# Altium project IO_Combo_V1_2.PrjPcb
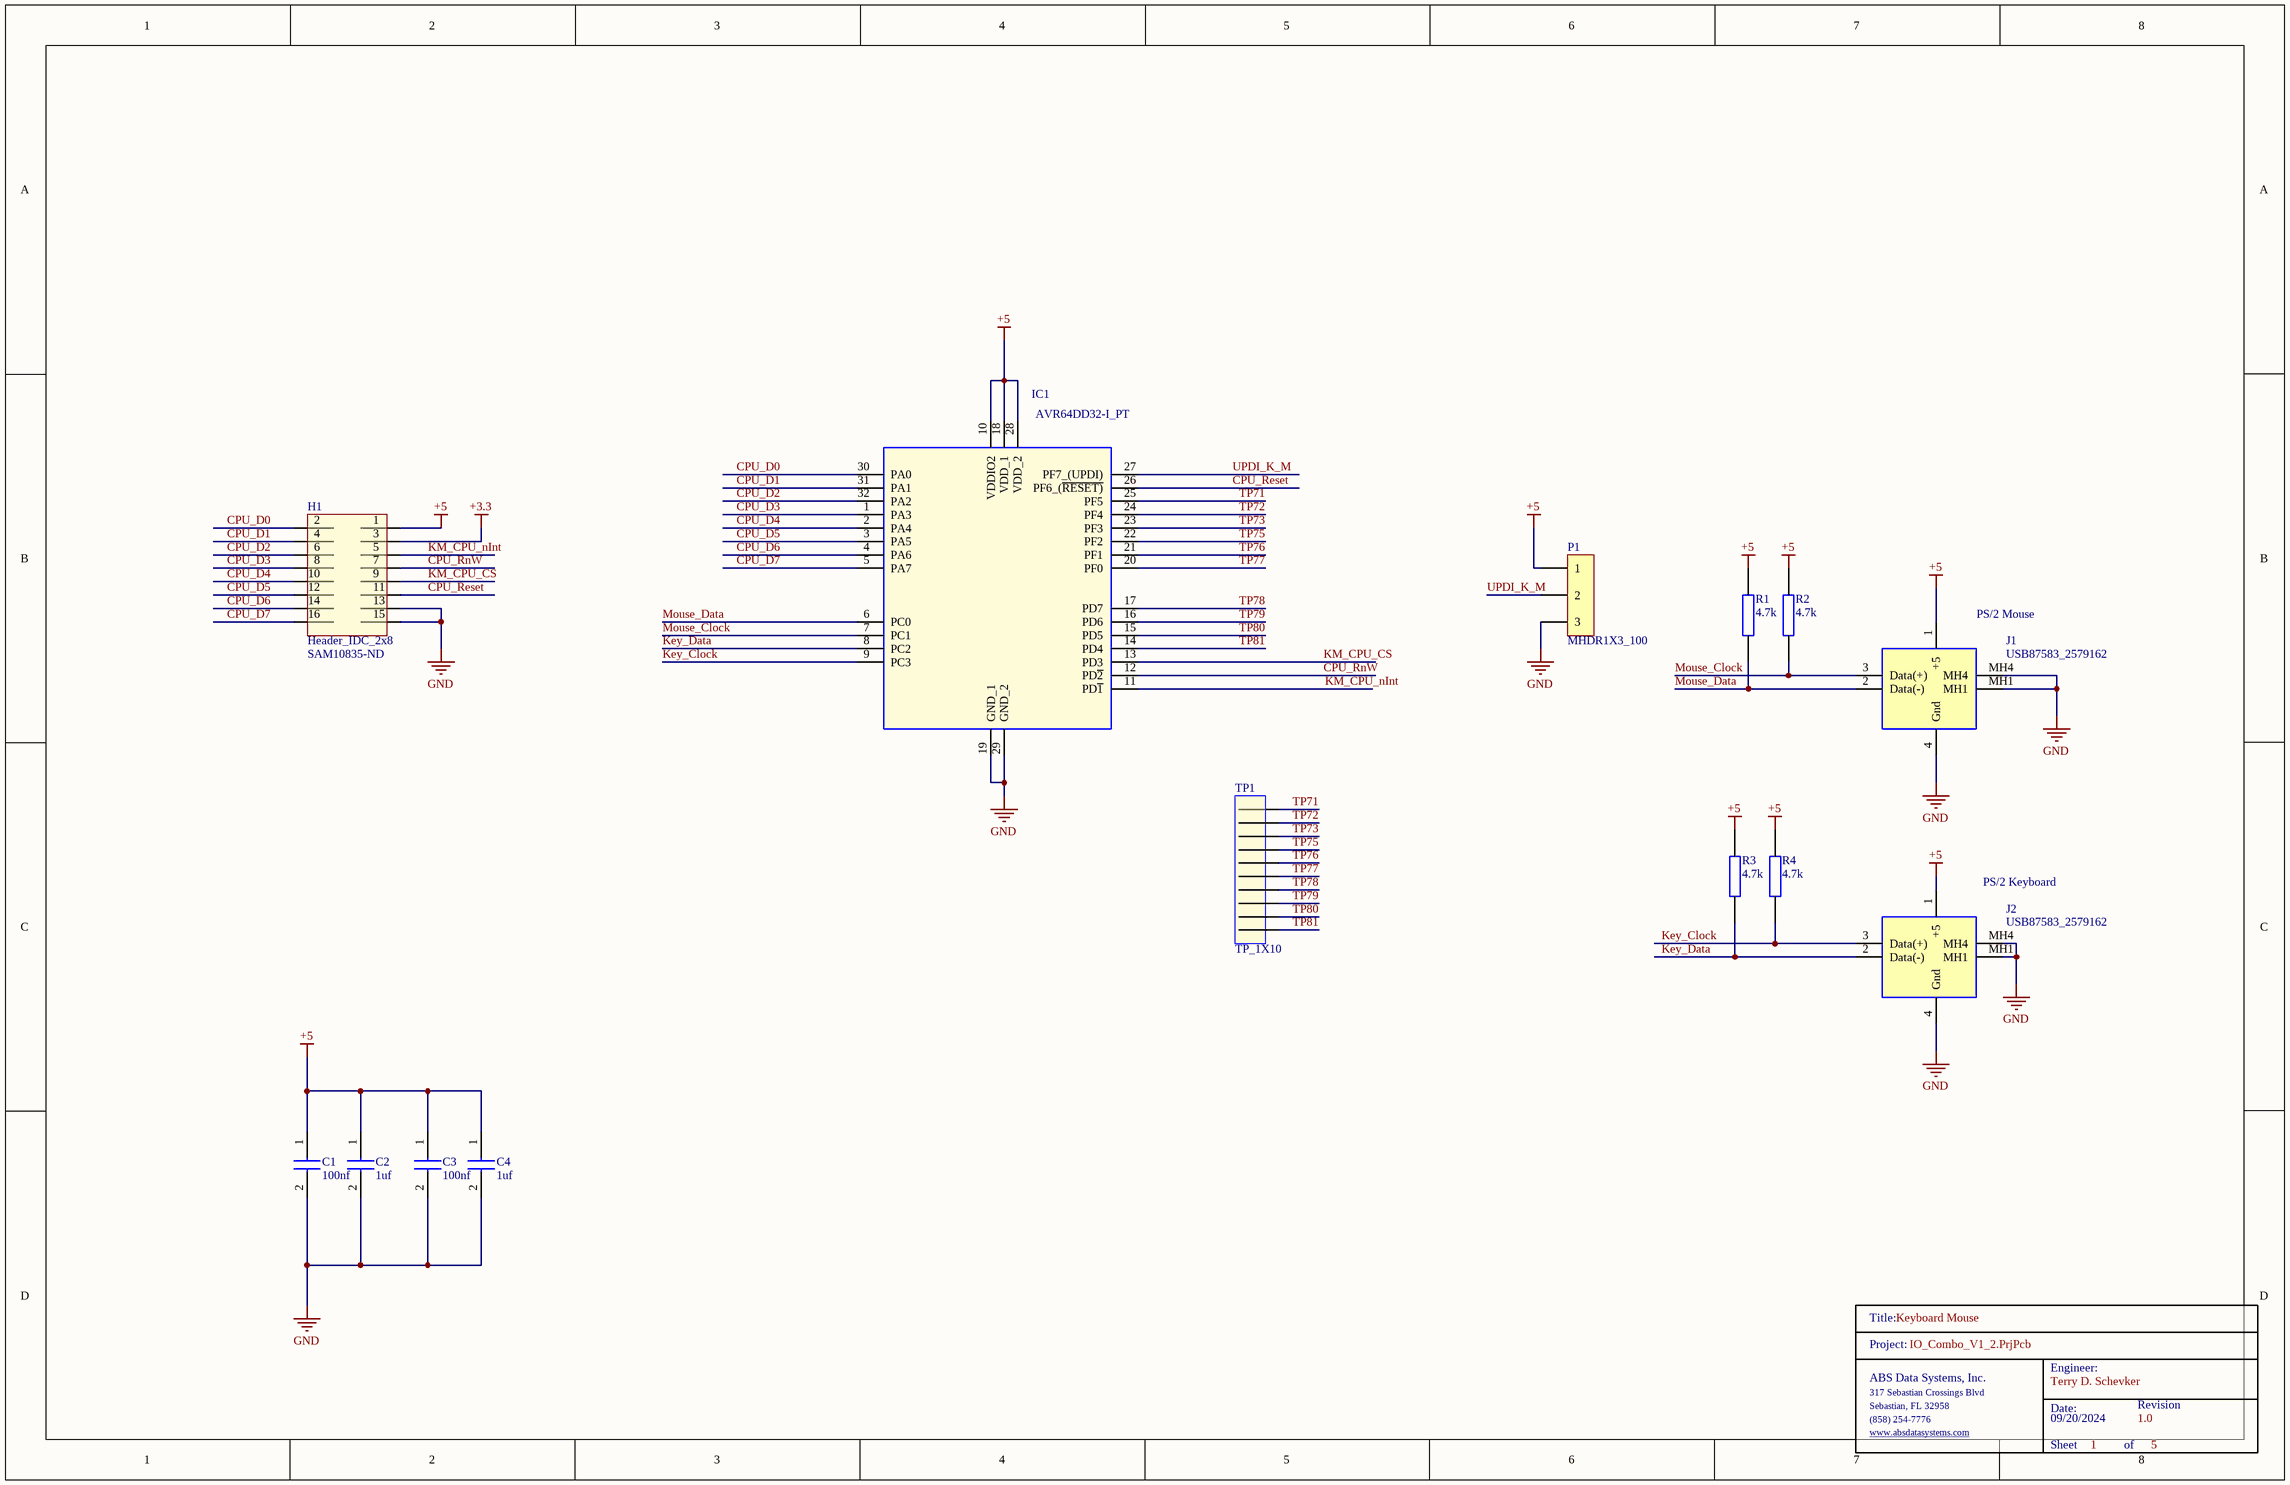
[diagram p0: IO_Combo_Keyboard_Mouse.SchDoc]
5 sheets, 131 parts. Net scope: global (net labels, ports and power ports of the same name join across sheets).
Board file: IO_Combo_V1_2PCB.PcbDoc
Sheets:
  IO_Combo_Keyboard_Mouse.SchDoc
  IO_Combo_LED_Monitor.SchDoc
  IO_Combo_SD.SchDoc
  IO_Combo_USB_Serial.SchDoc
  IO_Combo_WiFi.SchDoc

## Sheet IO_Combo_Keyboard_Mouse.SchDoc: Keyboard Mouse
size Tabloid; Date: 09/20/2024; Engineer: Terry D. Schevker; Revision: 1.0; SheetNumber: 1; SheetTotal: 5

### Parts
(Parts that share a designator on the sheet are numbered #1, #2 ... from top to bottom, then left to right.)
C1  100nf  [0603]
C2  1uf  [0603]
C3  100nf  [0603]
C4  1uf  [0603]
H1  Header_IDC_2x8  Supplier Part Number 1: SAM10835-ND  [HEADER16]
IC1  AVR64DD32-I_PT  [QFP80P900X900X120-32N]
J1  USB87583_2579162  [87583-2579162]
J2  USB87583_2579162  [87583-2579162]
P1  MHDR1X3_100  [MHDR1X3_100]
R1  4.7k  [0603]
R2  4.7k  [0603]
R3  4.7k  [0603]
R4  4.7k  [0603]
TitleBlock_1#1  TitleBlock  (value not drawn)  (graphical)
TP1  TP_1X10  [TP_1X10]

### Nets
+3.3: H1.3
+5: C1.1 C2.1 C3.1 C4.1 H1.1 IC1.10(VDDIO2) IC1.18(VDD_1) IC1.28(VDD_2) J1.1(+5) J2.1(+5) P1.1 R1.1 R2.1 R3.1 R4.1
GND: C1.2 C2.2 C3.2 C4.2 H1.13 H1.15 IC1.19(GND_1) IC1.29(GND_2) J1.4(Gnd) J1.MH1 J1.MH4 J2.4(Gnd) J2.MH1 J2.MH4 P1.3
CPU_D0: H1.2 IC1.30(PA0)
CPU_D1: H1.4 IC1.31(PA1)
CPU_D2: H1.6 IC1.32(PA2)
CPU_D3: H1.8 IC1.1(PA3)
CPU_D4: H1.10 IC1.2(PA4)
CPU_D5: H1.12 IC1.3(PA5)
CPU_D6: H1.14 IC1.4(PA6)
CPU_D7: H1.16 IC1.5(PA7)
CPU_Reset: H1.11 IC1.26(PF6_(~{RESET)})
CPU_RnW: H1.7 IC1.12(PD~{2})
Key_Clock: IC1.9(PC3) J2.3(Data(+)) R4.2
Key_Data: IC1.8(PC2) J2.2(Data(-)) R3.2
KM_CPU_CS: H1.9 IC1.13(PD3)
KM_CPU_nInt: H1.5 IC1.11(PD~{1})
Mouse_Clock: IC1.7(PC1) J1.3(Data(+)) R2.2
Mouse_Data: IC1.6(PC0) J1.2(Data(-)) R1.2
TP71: IC1.25(PF5) TP1.1
TP72: IC1.24(PF4) TP1.2
TP73: IC1.23(PF3) TP1.3
TP75: IC1.22(PF2) TP1.4
TP76: IC1.21(PF1) TP1.5
TP77: IC1.20(PF0) TP1.6
TP78: IC1.17(PD7) TP1.7
TP79: IC1.16(PD6) TP1.8
TP80: IC1.15(PD5) TP1.9
TP81: IC1.14(PD4) TP1.10
UPDI_K_M: IC1.27(PF7_(UPDI)) P1.2

### Notes on the sheet
- (near J1) PS/2 Mouse
- (near J2) PS/2 Keyboard
- (in symbol TitleBlock) Title:; Project:; Engineer:; ABS Data Systems, Inc.; 317 Sebastian Crossings Blvd; Sebastian, FL 32958; Date:; Revision; (858) 254-7776; www.absdatasystems.com; Sheet; of

### Library data of the parts
C1 C3 = CL10B104JB8NNNC: Samsung Electro-Mechanics 0603 100nf
C2 C4 = CL10B105KA8NNNL: Samsung Electro-Mechanics 0603 1uf
H1 = Header_IDC_2x8: 16 Pin 2x8 Through Hold IDC Connector; Manufacturer: Samtec; Manufacturer Part Number: TST-108-01-G-D; Number of Contacts: 16; Gender: Male; Connector Type: Male Pin; Pitch: 2.54mm; Row Spacing: 0.1inch; Supplier 1: Digi-Key; RoHS: Yes; Category: Headers and Wire Housings; Stock 1: 227; Pricing 1: 1=2.85000, 10=2.73600, 100=2.28000, 500=1.93800, 1000=1.65300, 5000=1.48200 (USD); Mount: Through Hole; Contact Plating: Gold; Contact Material: Bronze; Housing Material: Polyester; Housing Color: Black; Color: Black; Min Operating Temperature: -55°C; Max Operating Temperature: 125°C; Number of Rows: 2; Termination: Solder; Packaging: Rail/Tube; Orientation: Straight; Number of Positions: 16; Length: 27.94mm; Depth: 9.27mm; Contact Mating Length: 0.25inch; REACH SVHC: No SVHC; ComponentLink1URL: https://datasheet.ciiva.com/739/tst-mkt-739845.pdf?src-supplier=Digi-Key; ComponentLink1Description: https://datasheet.ciiva.com/739/tst-mkt-739845.pdf?src-supplier=Digi-Key; ComponentLink2URL: https://datasheet.ciiva.com/10018/htst-10018510.pdf?src-supplier=Avnet; ComponentLink2Description: https://datasheet.ciiva.com/10018/htst-10018510.pdf?src-supplier=Avnet
IC1 = AVR64DD32-I_PT: Integrated Circuit; Manufacturer_Name: Microchip; Manufacturer_Part_Number: AVR64DD32-I/PT | MULTI-VOLTAGE I/O; Datasheet Link: https://www.microchip.com/en-us/product/AVR64DD32; Height: 1.2mm
J1 J2 = USB87583_2579162: USB Connectors USB A Plug, SMT, R/A, GF, With Kinked shell stakes and posts, T&R; Manufacturer_Name: GCT (GLOBAL CONNECTOR TECHNOLOGY); Manufacturer_Part_Number: USB1061-GF-L-A; Geometry.Height: 4.6mm; Mouser Part Number: 640-USB1061-GF-L-A; Mouser Price/Stock: https://www.mouser.co.uk/ProductDetail/GCT/USB1061-GF-L-A?qs=KUoIvG%2F9IlYSthVIrIBVzQ%3D%3D; Datasheet Link: https://gct.co/connector/usb1061
P1 = MHDR1X3_100: Header, 3-Pin; LatestRevisionDate: 17-Jul-2002; LatestRevisionNote: Re-released for DXP Platform.; Publisher: Altium Limited
R1-R4 = RC0603FR-104K7L: YAGEO 0603 4.7k; Manufacturer_Name: KEMET; Manufacturer_Part_Number: RC0603JR-070RL; Geometry.Height: 0.55mm; Mouser Part Number: 603-RC0603JR-070RL; Mouser Price/Stock: https://www.mouser.co.uk/ProductDetail/YAGEO/RC0603JR-070RL?qs=2cAdsCoAWRGWyPcuXgGiXQ%3D%3D; Datasheet Link: https://datasheet.datasheetarchive.com/originals/distributors/Datasheets_SAMA/902f9e387b938f871d31120f5fc1d65e.pdf
TP1 = TP_1X10: Manufacturer: Samtec; Manufacturer Part Number: TST-105-01-G-D; Number of Contacts: 16; Gender: Male; Connector Type: Male Pin; Pitch: 2.54mm; Row Spacing: 0.1inch; Supplier 1: Digi-Key; RoHS: Yes; Category: Headers and Wire Housings; Stock 1: 227; Pricing 1: 1=2.85000, 10=2.73600, 100=2.28000, 500=1.93800, 1000=1.65300, 5000=1.48200 (USD); Mount: Through Hole; Contact Plating: Gold; Contact Material: Bronze; Housing Material: Polyester; Housing Color: Black; Color: Black; Min Operating Temperature: -55°C; Max Operating Temperature: 125°C; Number of Rows: 2; Termination: Solder; Packaging: Rail/Tube; Orientation: Straight; Number of Positions: 16; Length: 27.94mm; Depth: 9.27mm; Contact Mating Length: 0.25inch; REACH SVHC: No SVHC; ComponentLink1URL: https://datasheet.ciiva.com/739/tst-mkt-739845.pdf?src-supplier=Digi-Key; ComponentLink1Description: https://datasheet.ciiva.com/739/tst-mkt-739845.pdf?src-supplier=Digi-Key; ComponentLink2URL: https://datasheet.ciiva.com/10018/htst-10018510.pdf?src-supplier=Avnet; ComponentLink2Description: https://datasheet.ciiva.com/10018/htst-10018510.pdf?src-supplier=Avnet

## Sheet IO_Combo_LED_Monitor.SchDoc: LED Monitor
size Tabloid; Date: 09/21/2024; Engineer: Terry D. Schevker; Revision: 1.0; SheetNumber: 2; SheetTotal: 5
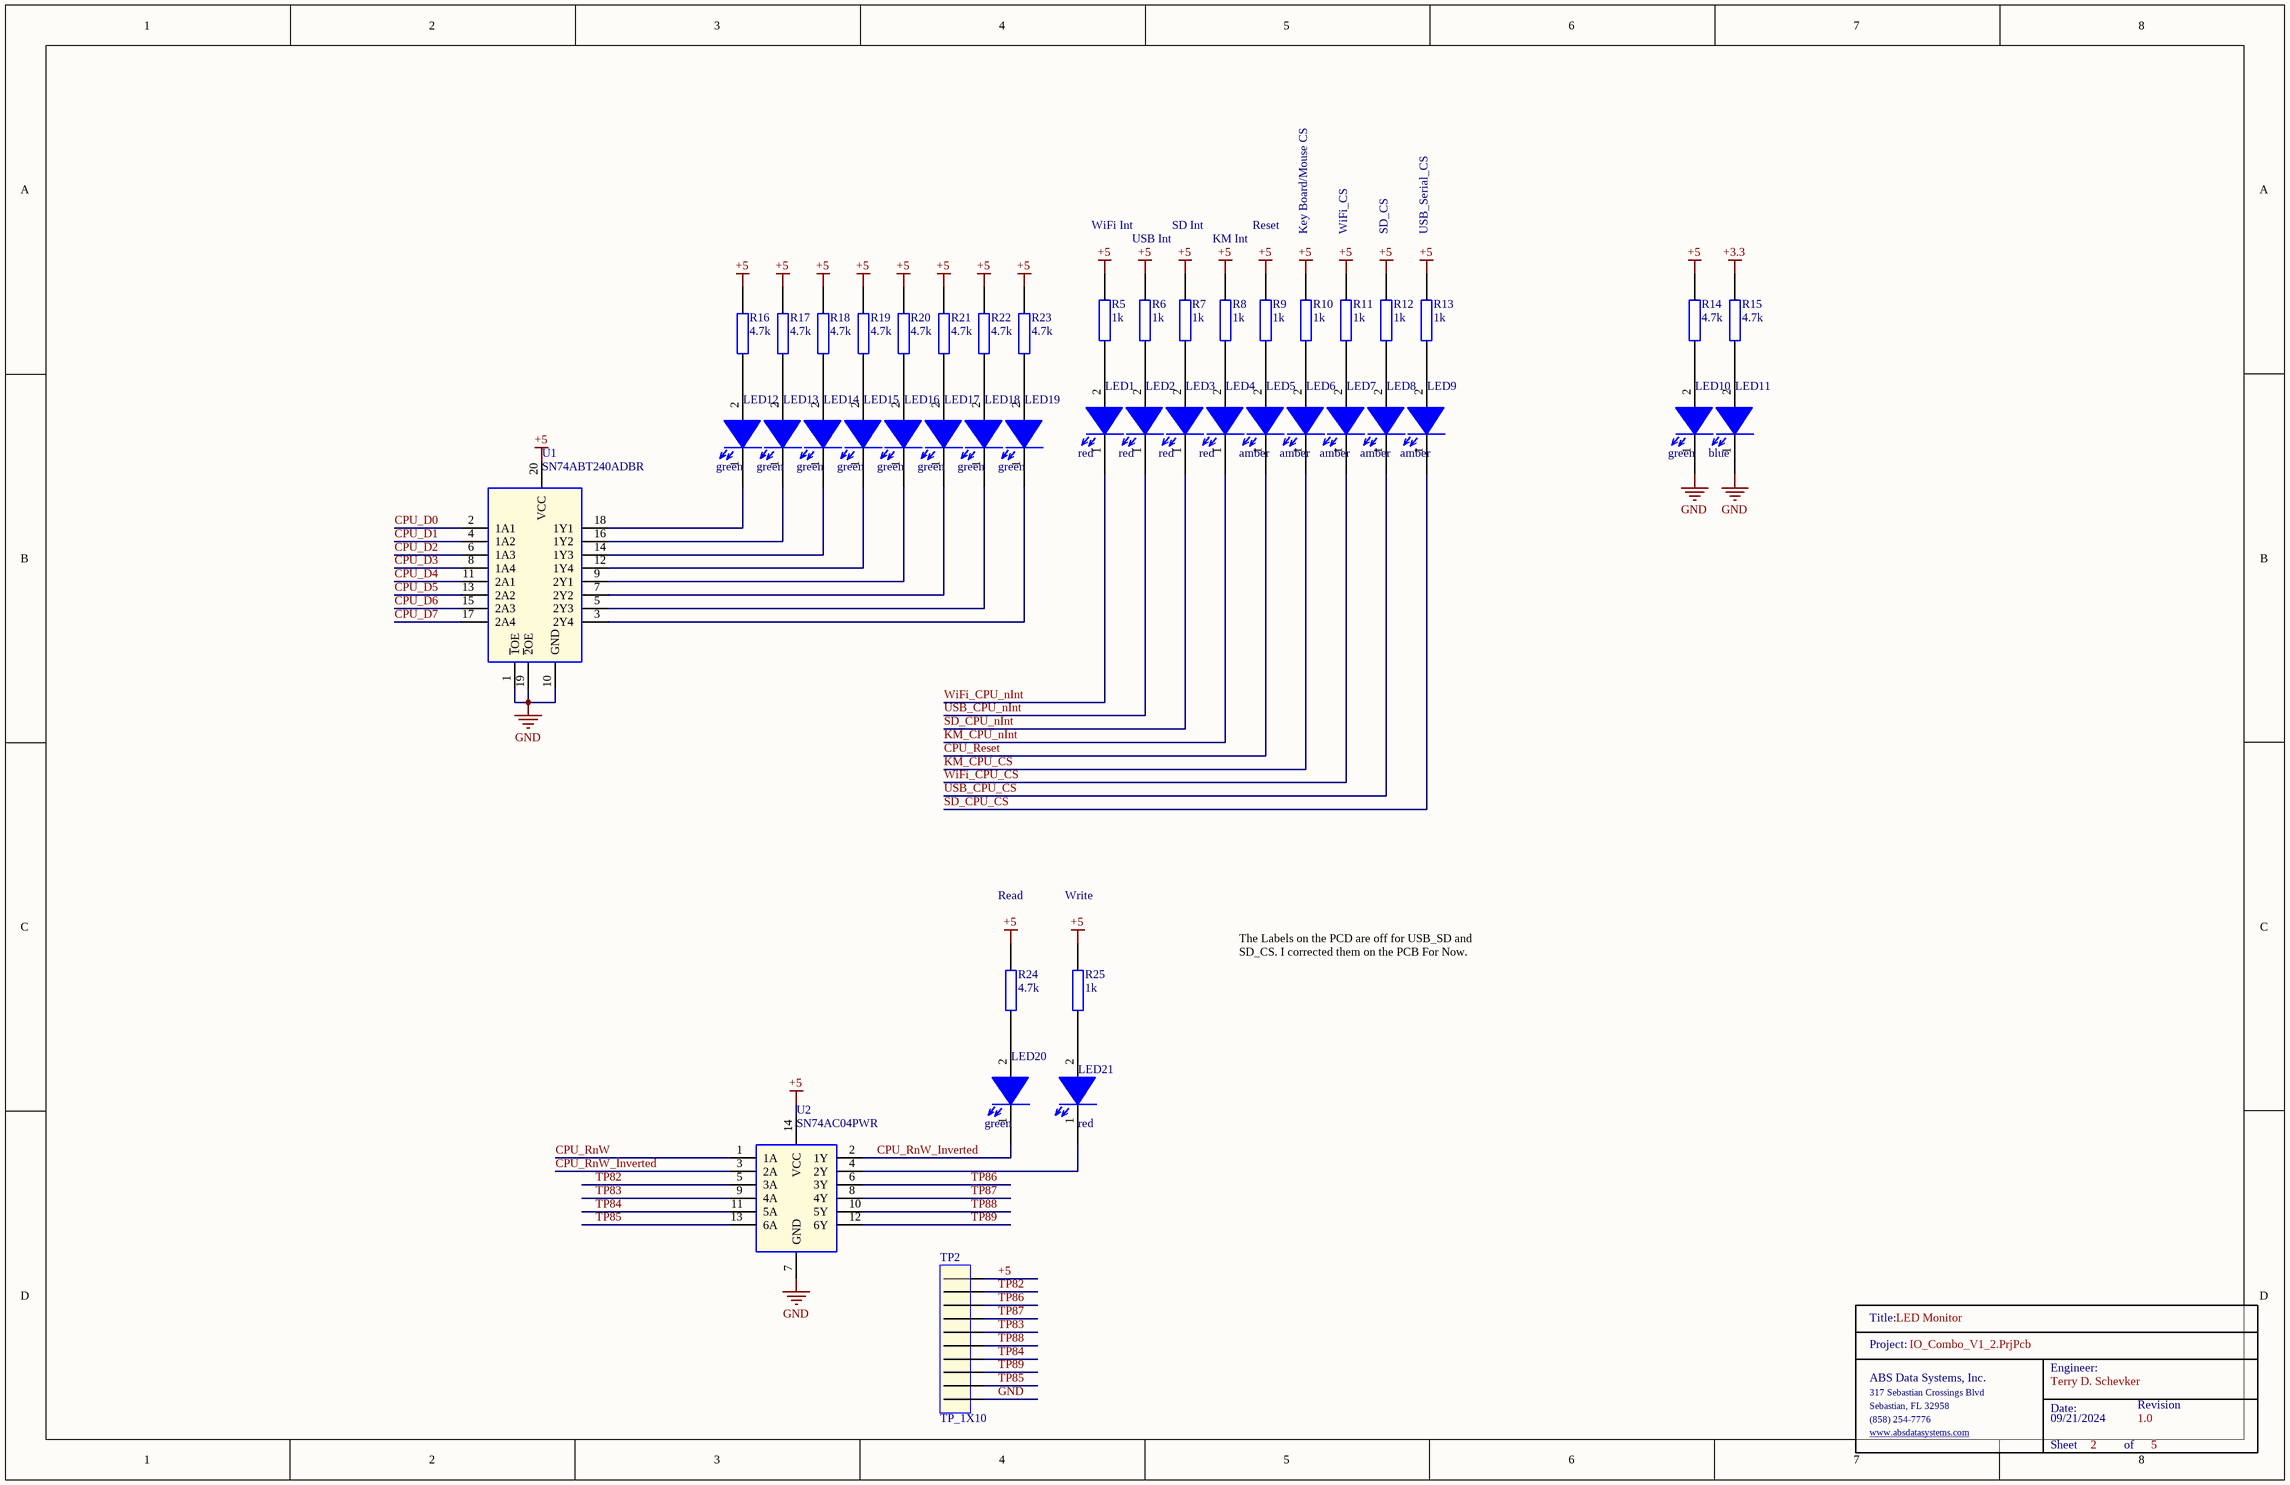
[diagram p1: IO_Combo_LED_Monitor.SchDoc]

### Parts
(Parts that share a designator on the sheet are numbered #1, #2 ... from top to bottom, then left to right.)
LED1  red  [0603_Diode]
LED2  red  [0603_Diode]
LED3  red  [0603_Diode]
LED4  red  [0603_Diode]
LED5  amber  [0603_Diode]
LED6  amber  [0603_Diode]
LED7  amber  [0603_Diode]
LED8  amber  [0603_Diode]
LED9  amber  [0603_Diode]
LED10  green  [0603_Diode]
LED11  blue  [0603_Diode]
LED12  green  [0603_Diode]
LED13  green  [0603_Diode]
LED14  green  [0603_Diode]
LED15  green  [0603_Diode]
LED16  green  [0603_Diode]
LED17  green  [0603_Diode]
LED18  green  [0603_Diode]
LED19  green  [0603_Diode]
LED20  green  [0603_Diode]
LED21  red  [0603_Diode]
R5  1k  [0603]
R6  1k  [0603]
R7  1k  [0603]
R8  1k  [0603]
R9  1k  [0603]
R10  1k  [0603]
R11  1k  [0603]
R12  1k  [0603]
R13  1k  [0603]
R14  4.7k  [0603]
R15  4.7k  [0603]
R16  4.7k  [0603]
R17  4.7k  [0603]
R18  4.7k  [0603]
R19  4.7k  [0603]
R20  4.7k  [0603]
R21  4.7k  [0603]
R22  4.7k  [0603]
R23  4.7k  [0603]
R24  4.7k  [0603]
R25  1k  [0603]
TitleBlock_1#2  TitleBlock  (value not drawn)  (graphical)
TP2  TP_1X10  [TP_1X10]
U1  SN74ABT240ADBR  [SOP65P780X200-20N]
U2  SN74AC04PWR  [SOP65P640X120-14N]

### Nets
+3.3: R15.2
+5: R5.2 R6.2 R7.2 R8.2 R9.2 R10.2 R11.2 R12.2 R13.2 R14.2 R16.2 R17.2 R18.2 R19.2 R20.2 R21.2 R22.2 R23.2 R24.2 R25.2 TP2.1 U1.20(VCC) U2.14(VCC)
GND: LED10.1(K) LED11.1(K) TP2.10 U1.1(~{1}OE) U1.10(GND) U1.19(~{2}OE) U2.7(GND)
CPU_D0: U1.2(1A1)
CPU_D1: U1.4(1A2)
CPU_D2: U1.6(1A3)
CPU_D3: U1.8(1A4)
CPU_D4: U1.11(2A1)
CPU_D5: U1.13(2A2)
CPU_D6: U1.15(2A3)
CPU_D7: U1.17(2A4)
CPU_Reset: LED5.1(K)
CPU_RnW: U2.1(1A)
CPU_RnW_Inverted: LED20.1(K) U2.2(1Y) U2.3(2A)
KM_CPU_CS: LED6.1(K)
KM_CPU_nInt: LED4.1(K)
SD_CPU_CS: LED9.1(K)
SD_CPU_nInt: LED3.1(K)
TP82: TP2.2 U2.5(3A)
TP83: TP2.5 U2.9(4A)
TP84: TP2.7 U2.11(5A)
TP85: TP2.9 U2.13(6A)
TP86: TP2.3 U2.6(3Y)
TP87: TP2.4 U2.8(4Y)
TP88: TP2.6 U2.10(5Y)
TP89: TP2.8 U2.12(6Y)
USB_CPU_CS: LED8.1(K)
USB_CPU_nInt: LED2.1(K)
WiFi_CPU_CS: LED7.1(K)
WiFi_CPU_nInt: LED1.1(K)
NetLED1_2: LED1.2(A) R5.1
NetLED2_2: LED2.2(A) R6.1
NetLED3_2: LED3.2(A) R7.1
NetLED4_2: LED4.2(A) R8.1
NetLED5_2: LED5.2(A) R9.1
NetLED6_2: LED6.2(A) R10.1
NetLED7_2: LED7.2(A) R11.1
NetLED8_2: LED8.2(A) R12.1
NetLED9_2: LED9.2(A) R13.1
NetLED10_2: LED10.2(A) R14.1
NetLED11_2: LED11.2(A) R15.1
NetLED12_1: LED12.1(K) U1.18(1Y1)
NetLED12_2: LED12.2(A) R16.1
NetLED13_1: LED13.1(K) U1.16(1Y2)
NetLED13_2: LED13.2(A) R17.1
NetLED14_1: LED14.1(K) U1.14(1Y3)
NetLED14_2: LED14.2(A) R18.1
NetLED15_1: LED15.1(K) U1.12(1Y4)
NetLED15_2: LED15.2(A) R19.1
NetLED16_1: LED16.1(K) U1.9(2Y1)
NetLED16_2: LED16.2(A) R20.1
NetLED17_1: LED17.1(K) U1.7(2Y2)
NetLED17_2: LED17.2(A) R21.1
NetLED18_1: LED18.1(K) U1.5(2Y3)
NetLED18_2: LED18.2(A) R22.1
NetLED19_1: LED19.1(K) U1.3(2Y4)
NetLED19_2: LED19.2(A) R23.1
NetLED20_2: LED20.2(A) R24.1
NetLED21_1: LED21.1(K) U2.4(2Y)
NetLED21_2: LED21.2(A) R25.1

### Notes on the sheet
- WiFi Int
- SD Int
- Reset
- Key Board/Mouse CS
- WiFi_CS
- SD_CS
- USB_Serial_CS
- USB Int
- KM Int
- Read
- Write
- The Labels on the PCD are off for USB_SD and SD_CS. I corrected them on the PCB For Now.
- (in symbol TitleBlock) Title:; Project:; Engineer:; ABS Data Systems, Inc.; 317 Sebastian Crossings Blvd; Sebastian, FL 32958; Date:; Revision; (858) 254-7776; www.absdatasystems.com; Sheet; of

### Library data of the parts
LED1-LED4 LED21 = 150060RS75000: Wurth Elektronik 0603 red; Manufacturer: Wurth Electronics; Manufacturer Part Number: 150060GS75000; Color: Green; Wavelength: 520nm; Viewing Angle: 140°; Lens Style: Clear,Rectangular; Luminous Intensity: 430mcd; Forward Current: 30mA; Forward Voltage: 3.2V; Test Current: 20mA; Supplier 1: Digi-Key; RoHS: Yes; Category: LEDs; Stock 1: 71509; Pricing 1: 1=0.14000, 50=0.13300, 100=0.11400, 500=0.09900 (USD); Mount: Surface Mount; Case/Package: 0603; Case Code (Metric): 1608; Case Code (Imperial): 0603; Min Operating Temperature: -40°C; Max Operating Temperature: 85°C; Package Quantity: 4000; Packaging: Tape and Reel; Dominant Wavelength: 520nm; Length: 1.6mm; Width: 0.8mm; Height: 0.7mm; REACH SVHC: Unknown; Lead Free: Lead Free; ComponentLink1URL: https://datasheet.ciiva.com/29562/150060gs75000-29562868.pdf?src-supplier=Digi-Key; ComponentLink1Description: https://datasheet.ciiva.com/29562/150060gs75000-29562868.pdf?src-supplier=Digi-Key; ComponentLink2URL: https://datasheet.ciiva.com/29279/759427-da-01-en-chipled-0603-w-kl-gruen-150060gs75000-29279201.pdf?src-supplier=Conrad; ComponentLink2Description: https://datasheet.ciiva.com/29279/759427-da-01-en-chipled-0603-w-kl-gruen-150060gs75000-29279201.pdf?src-supplier=Conrad; ComponentLink3URL: https://datasheet.ciiva.com/29562/150060gs75000-29562869.pdf?src-supplier=Digi-Key; ComponentLink3Description: https://datasheet.ciiva.com/29562/150060gs75000-29562869.pdf?src-supplier=Digi-Key; ComponentLink4URL: https://datasheet.ciiva.com/29562/150060gs75000-29562870.pdf?src-supplier=Digi-Key; ComponentLink4Description: https://datasheet.ciiva.com/29562/150060gs75000-29562870.pdf?src-supplier=Digi-Key
LED5-LED9 = 150060AS75000: Wurth Elektronik 0603 amber; Manufacturer: Wurth Electronics; Manufacturer Part Number: 150060GS75000; Color: Green; Wavelength: 520nm; Viewing Angle: 140°; Lens Style: Clear,Rectangular; Luminous Intensity: 430mcd; Forward Current: 30mA; Forward Voltage: 3.2V; Test Current: 20mA; Supplier 1: Digi-Key; RoHS: Yes; Category: LEDs; Stock 1: 71509; Pricing 1: 1=0.14000, 50=0.13300, 100=0.11400, 500=0.09900 (USD); Mount: Surface Mount; Case/Package: 0603; Case Code (Metric): 1608; Case Code (Imperial): 0603; Min Operating Temperature: -40°C; Max Operating Temperature: 85°C; Package Quantity: 4000; Packaging: Tape and Reel; Dominant Wavelength: 520nm; Length: 1.6mm; Width: 0.8mm; Height: 0.7mm; REACH SVHC: Unknown; Lead Free: Lead Free; ComponentLink1URL: https://datasheet.ciiva.com/29562/150060gs75000-29562868.pdf?src-supplier=Digi-Key; ComponentLink1Description: https://datasheet.ciiva.com/29562/150060gs75000-29562868.pdf?src-supplier=Digi-Key; ComponentLink2URL: https://datasheet.ciiva.com/29279/759427-da-01-en-chipled-0603-w-kl-gruen-150060gs75000-29279201.pdf?src-supplier=Conrad; ComponentLink2Description: https://datasheet.ciiva.com/29279/759427-da-01-en-chipled-0603-w-kl-gruen-150060gs75000-29279201.pdf?src-supplier=Conrad; ComponentLink3URL: https://datasheet.ciiva.com/29562/150060gs75000-29562869.pdf?src-supplier=Digi-Key; ComponentLink3Description: https://datasheet.ciiva.com/29562/150060gs75000-29562869.pdf?src-supplier=Digi-Key; ComponentLink4URL: https://datasheet.ciiva.com/29562/150060gs75000-29562870.pdf?src-supplier=Digi-Key; ComponentLink4Description: https://datasheet.ciiva.com/29562/150060gs75000-29562870.pdf?src-supplier=Digi-Key
LED10 LED12-LED20 = 150060GS75000: Wurth Elektronik 0603 green; Manufacturer: Wurth Electronics; Wavelength: 520nm; Viewing Angle: 140°; Lens Style: Clear,Rectangular; Luminous Intensity: 430mcd; Forward Current: 30mA; Forward Voltage: 3.2V; Test Current: 20mA; Supplier 1: Digi-Key; Manufacturer Part Number: 150060GS75000; RoHS: Yes; Category: LEDs; Stock 1: 71509; Pricing 1: 1=0.14000, 50=0.13300, 100=0.11400, 500=0.09900 (USD); Mount: Surface Mount; Case/Package: 0603; Color: Green; Case Code (Metric): 1608; Case Code (Imperial): 0603; Min Operating Temperature: -40°C; Max Operating Temperature: 85°C; Package Quantity: 4000; Packaging: Tape and Reel; Dominant Wavelength: 520nm; Length: 1.6mm; Width: 0.8mm; Height: 0.7mm; REACH SVHC: Unknown; Lead Free: Lead Free; ComponentLink1URL: https://datasheet.ciiva.com/29562/150060gs75000-29562868.pdf?src-supplier=Digi-Key; ComponentLink1Description: https://datasheet.ciiva.com/29562/150060gs75000-29562868.pdf?src-supplier=Digi-Key; ComponentLink2URL: https://datasheet.ciiva.com/29279/759427-da-01-en-chipled-0603-w-kl-gruen-150060gs75000-29279201.pdf?src-supplier=Conrad; ComponentLink2Description: https://datasheet.ciiva.com/29279/759427-da-01-en-chipled-0603-w-kl-gruen-150060gs75000-29279201.pdf?src-supplier=Conrad; ComponentLink3URL: https://datasheet.ciiva.com/29562/150060gs75000-29562869.pdf?src-supplier=Digi-Key; ComponentLink3Description: https://datasheet.ciiva.com/29562/150060gs75000-29562869.pdf?src-supplier=Digi-Key; ComponentLink4URL: https://datasheet.ciiva.com/29562/150060gs75000-29562870.pdf?src-supplier=Digi-Key; ComponentLink4Description: https://datasheet.ciiva.com/29562/150060gs75000-29562870.pdf?src-supplier=Digi-Key
LED11 = 150060BS75000: Wurth Elektronik 0603 blue; Manufacturer: Wurth Electronics; Manufacturer Part Number: 150060GS75000; Color: Green; Wavelength: 520nm; Viewing Angle: 140°; Lens Style: Clear,Rectangular; Luminous Intensity: 430mcd; Forward Current: 30mA; Forward Voltage: 3.2V; Test Current: 20mA; Supplier 1: Digi-Key; RoHS: Yes; Category: LEDs; Stock 1: 71509; Pricing 1: 1=0.14000, 50=0.13300, 100=0.11400, 500=0.09900 (USD); Mount: Surface Mount; Case/Package: 0603; Case Code (Metric): 1608; Case Code (Imperial): 0603; Min Operating Temperature: -40°C; Max Operating Temperature: 85°C; Package Quantity: 4000; Packaging: Tape and Reel; Dominant Wavelength: 520nm; Length: 1.6mm; Width: 0.8mm; Height: 0.7mm; REACH SVHC: Unknown; Lead Free: Lead Free; ComponentLink1URL: https://datasheet.ciiva.com/29562/150060gs75000-29562868.pdf?src-supplier=Digi-Key; ComponentLink1Description: https://datasheet.ciiva.com/29562/150060gs75000-29562868.pdf?src-supplier=Digi-Key; ComponentLink2URL: https://datasheet.ciiva.com/29279/759427-da-01-en-chipled-0603-w-kl-gruen-150060gs75000-29279201.pdf?src-supplier=Conrad; ComponentLink2Description: https://datasheet.ciiva.com/29279/759427-da-01-en-chipled-0603-w-kl-gruen-150060gs75000-29279201.pdf?src-supplier=Conrad; ComponentLink3URL: https://datasheet.ciiva.com/29562/150060gs75000-29562869.pdf?src-supplier=Digi-Key; ComponentLink3Description: https://datasheet.ciiva.com/29562/150060gs75000-29562869.pdf?src-supplier=Digi-Key; ComponentLink4URL: https://datasheet.ciiva.com/29562/150060gs75000-29562870.pdf?src-supplier=Digi-Key; ComponentLink4Description: https://datasheet.ciiva.com/29562/150060gs75000-29562870.pdf?src-supplier=Digi-Key
R5-R13 R25 = AC0603FR-7W1KL_1: YAGEO 0603 1k ohm; Manufacturer_Name: KEMET; Manufacturer_Part_Number: RC0603JR-070RL; Geometry.Height: 0.55mm; Mouser Part Number: 603-RC0603JR-070RL; Mouser Price/Stock: https://www.mouser.co.uk/ProductDetail/YAGEO/RC0603JR-070RL?qs=2cAdsCoAWRGWyPcuXgGiXQ%3D%3D; Datasheet Link: https://datasheet.datasheetarchive.com/originals/distributors/Datasheets_SAMA/902f9e387b938f871d31120f5fc1d65e.pdf
R14-R24 = RC0603FR-104K7L: as R1 on sheet IO_Combo_Keyboard_Mouse; Mouser Part Number: 603-RC0603JR-070RL; Mouser Price/Stock: https://www.mouser.co.uk/ProductDetail/YAGEO/RC0603JR-070RL?qs=2cAdsCoAWRGWyPcuXgGiXQ%3D%3D; Datasheet Link: https://datasheet.datasheetarchive.com/originals/distributors/Datasheets_SAMA/902f9e387b938f871d31120f5fc1d65e.pdf
TP2 = TP_1X10: as TP1 on sheet IO_Combo_Keyboard_Mouse; Supplier 1: Digi-Key; RoHS: Yes; Category: Headers and Wire Housings; Stock 1: 227; Pricing 1: 1=2.85000, 10=2.73600, 100=2.28000, 500=1.93800, 1000=1.65300, 5000=1.48200 (USD); Mount: Through Hole; Contact Plating: Gold; Contact Material: Bronze; Housing Material: Polyester; Housing Color: Black; Color: Black; Min Operating Temperature: -55°C; Max Operating Temperature: 125°C; Number of Rows: 2; Termination: Solder; Packaging: Rail/Tube; Orientation: Straight; Number of Positions: 16; Length: 27.94mm; Depth: 9.27mm; Contact Mating Length: 0.25inch; REACH SVHC: No SVHC; ComponentLink1URL: https://datasheet.ciiva.com/739/tst-mkt-739845.pdf?src-supplier=Digi-Key; ComponentLink1Description: https://datasheet.ciiva.com/739/tst-mkt-739845.pdf?src-supplier=Digi-Key; ComponentLink2URL: https://datasheet.ciiva.com/10018/htst-10018510.pdf?src-supplier=Avnet; ComponentLink2Description: https://datasheet.ciiva.com/10018/htst-10018510.pdf?src-supplier=Avnet
U1 = SN74ABT240ADBR: Octal Buffers/Drivers With 3-State Outputs; Manufacturer_Name: Texas Instruments; Geometry.Height: 2mm; Mouser Part Number: 595-SN74ABT240ADBR; Mouser Price/Stock: https://www.mouser.co.uk/ProductDetail/Texas-Instruments/SN74ABT240ADBR?qs=JHHQeKcAU3Dt82k%252BVyiYdw%3D%3D; Manufacturer_Part_Number: SN74ABT240ADBR; Datasheet Link: http://www.ti.com/lit/gpn/sn74abt240a
U2 = SN74AC04PWR: Hex Inverters; Manufacturer_Name: Texas Instruments; Geometry.Height: 1.2mm; Mouser Part Number: 595-SN74AC04PWR; Mouser Price/Stock: https://www.mouser.co.uk/ProductDetail/Texas-Instruments/SN74AC04PWR?qs=RZS%252BpEsUn7pRvPNqsga4SA%3D%3D; Manufacturer_Part_Number: SN74AC04PWR; Datasheet Link: http://www.ti.com/lit/gpn/sn74ac04

## Sheet IO_Combo_SD.SchDoc: SD Card
size Tabloid; Date: 09/21/2024; Engineer: Terry D. Schevker; Revision: 1.0; SheetNumber: 3; SheetTotal: 5
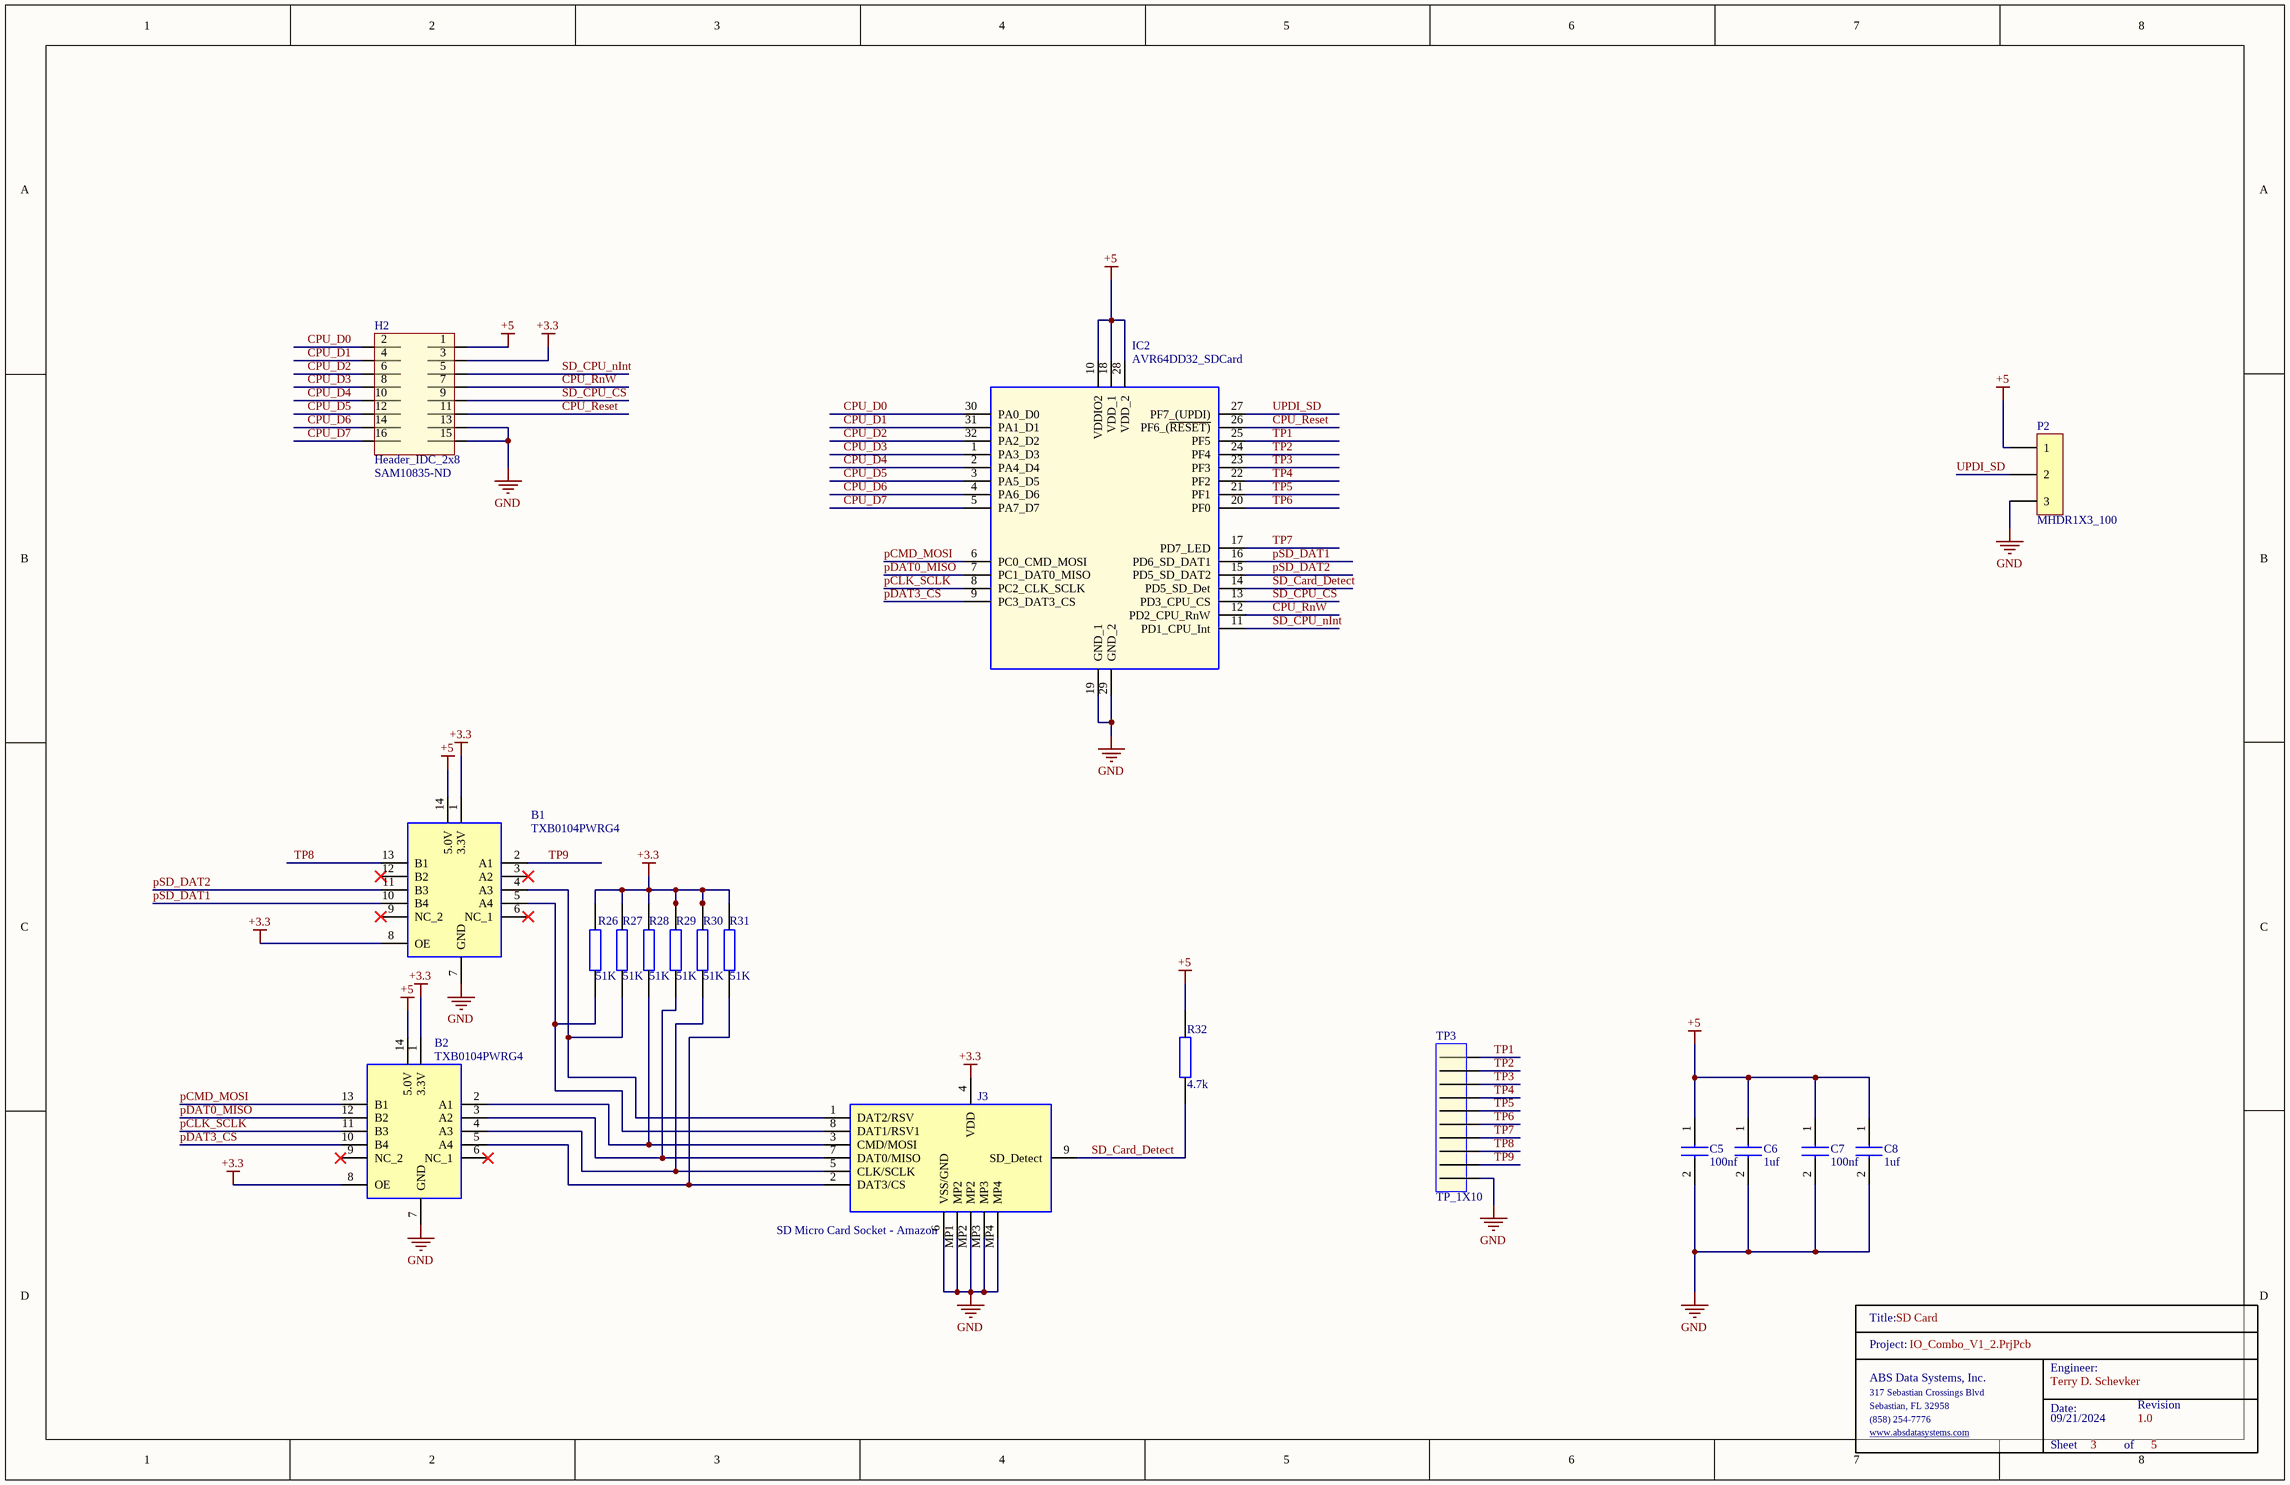
[diagram p2: IO_Combo_SD.SchDoc]

### Parts
(Parts that share a designator on the sheet are numbered #1, #2 ... from top to bottom, then left to right.)
B1  TXB0104PWRG4  [SOP65P640X120-14N]
B2  TXB0104PWRG4  [SOP65P640X120-14N]
C5  100nf  [0603]
C6  1uf  [0603]
C7  100nf  [0603]
C8  1uf  [0603]
H2  Header_IDC_2x8  Supplier Part Number 1: SAM10835-ND  [HEADER16]
IC2  AVR64DD32_SDCard  [QFP80P900X900X120-32N]
J3  SD Micro Card Socket - Amazon  [SDMicroConnector]
P2  MHDR1X3_100  [MHDR1X3_100]
R26  51K  [0603]
R27  51K  [0603]
R28  51K  [0603]
R29  51K  [0603]
R30  51K  [0603]
R31  51K  [0603]
R32  4.7k  [0603]
TitleBlock_1#3  TitleBlock  (value not drawn)  (graphical)
TP3  TP_1X10  [TP_1X10]

### Nets
+3.3: B1.1(3.3V) B1.8(OE) B2.1(3.3V) B2.8(OE) H2.3 J3.4(VDD) R26.1 R27.1 R28.1 R29.1 R30.1 R31.1
+5: B1.14(5.0V) B2.14(5.0V) C5.1 C6.1 C7.1 C8.1 H2.1 IC2.10(VDDIO2) IC2.18(VDD_1) IC2.28(VDD_2) P2.1 R32.2
GND: B1.7(GND) B2.7(GND) C5.2 C6.2 C7.2 C8.2 H2.13 H2.15 IC2.19(GND_1) IC2.29(GND_2) J3.6(VSS/GND) J3.MP1(MP2) J3.MP2 J3.MP3 J3.MP4 P2.3 TP3.10
CPU_D0: H2.2 IC2.30(PA0_D0)
CPU_D1: H2.4 IC2.31(PA1_D1)
CPU_D2: H2.6 IC2.32(PA2_D2)
CPU_D3: H2.8 IC2.1(PA3_D3)
CPU_D4: H2.10 IC2.2(PA4_D4)
CPU_D5: H2.12 IC2.3(PA5_D5)
CPU_D6: H2.14 IC2.4(PA6_D6)
CPU_D7: H2.16 IC2.5(PA7_D7)
CPU_Reset: H2.11 IC2.26(PF6_(~{RESET)})
CPU_RnW: H2.7 IC2.12(PD2_CPU_RnW)
pCLK_SCLK: B2.11(B3) IC2.8(PC2_CLK_SCLK)
pCMD_MOSI: B2.13(B1) IC2.6(PC0_CMD_MOSI)
pDAT0_MISO: B2.12(B2) IC2.7(PC1_DAT0_MISO)
pDAT3_CS: B2.10(B4) IC2.9(PC3_DAT3_CS)
pSD_DAT1: B1.10(B4) IC2.16(PD6_SD_DAT1)
pSD_DAT2: B1.11(B3) IC2.15(PD5_SD_DAT2)
SD_Card_Detect: IC2.14(PD5_SD_Det) J3.9(SD_Detect) R32.1
SD_CPU_CS: H2.9 IC2.13(PD3_CPU_CS)
SD_CPU_nInt: H2.5 IC2.11(PD1_CPU_Int)
TP1: IC2.25(PF5) TP3.1
TP2: IC2.24(PF4) TP3.2
TP3: IC2.23(PF3) TP3.3
TP4: IC2.22(PF2) TP3.4
TP5: IC2.21(PF1) TP3.5
TP6: IC2.20(PF0) TP3.6
TP7: IC2.17(PD7_LED) TP3.7
TP8: B1.13(B1) TP3.8
TP9: B1.2(A1) TP3.9
UPDI_SD: IC2.27(PF7_(UPDI)) P2.2
NetB1_4: B1.4(A3) J3.1(DAT2/RSV) R27.2
NetB1_5: B1.5(A4) J3.8(DAT1/RSV1) R26.2
NetB2_2: B2.2(A1) J3.3(CMD/MOSI) R28.2
NetB2_3: B2.3(A2) J3.7(DAT0/MISO) R29.2
NetB2_4: B2.4(A3) J3.5(CLK/SCLK) R30.2
NetB2_5: B2.5(A4) J3.2(DAT3/CS) R31.2

Not connected (* = marked no-connect by the designer): B1 3(A2)* 6(NC_1)* 9(NC_2)* 12(B2)*; B2 6(NC_1)* 9(NC_2)*

### Notes on the sheet
- (in symbol TitleBlock) Title:; Project:; Engineer:; ABS Data Systems, Inc.; 317 Sebastian Crossings Blvd; Sebastian, FL 32958; Date:; Revision; (858) 254-7776; www.absdatasystems.com; Sheet; of

### Library data of the parts
B1 B2 = TXB0104PWRG4: Texas Instruments TXB0104PWRG4, Voltage Level Translator, 3-State, 1.2  3.6 V, 1.65  5.5 V, 14-Pin TSSOP; Geometry.Height: 1.2mm; Mouser Part Number: 595-TXB0104PWRG4; Mouser Price/Stock: https://www.mouser.co.uk/ProductDetail/Texas-Instruments/TXB0104PWRG4?qs=oFXvjAmG9EjoQ0gyZ%252BZWbg%3D%3D; Manufacturer_Name: Texas Instruments; Manufacturer_Part_Number: TXB0104PWRG4; Datasheet Link: https://datasheet.datasheetarchive.com/originals/distributors/SFDatasheet-6/sf-000131436.pdf
C5 C7 = CL10B104JB8NNNC: Samsung Electro-Mechanics 0603 100nf
C6 C8 = CL10B105KA8NNNL: Samsung Electro-Mechanics 0603 1uf
H2 = Header_IDC_2x8: as H1 on sheet IO_Combo_Keyboard_Mouse; Supplier 1: Digi-Key; RoHS: Yes; Category: Headers and Wire Housings; Stock 1: 227; Pricing 1: 1=2.85000, 10=2.73600, 100=2.28000, 500=1.93800, 1000=1.65300, 5000=1.48200 (USD); Mount: Through Hole; Contact Plating: Gold; Contact Material: Bronze; Housing Material: Polyester; Housing Color: Black; Color: Black; Min Operating Temperature: -55°C; Max Operating Temperature: 125°C; Number of Rows: 2; Termination: Solder; Packaging: Rail/Tube; Orientation: Straight; Number of Positions: 16; Length: 27.94mm; Depth: 9.27mm; Contact Mating Length: 0.25inch; REACH SVHC: No SVHC; ComponentLink1URL: https://datasheet.ciiva.com/739/tst-mkt-739845.pdf?src-supplier=Digi-Key; ComponentLink1Description: https://datasheet.ciiva.com/739/tst-mkt-739845.pdf?src-supplier=Digi-Key; ComponentLink2URL: https://datasheet.ciiva.com/10018/htst-10018510.pdf?src-supplier=Avnet; ComponentLink2Description: https://datasheet.ciiva.com/10018/htst-10018510.pdf?src-supplier=Avnet
IC2 = AVR64DD32_SDCard: Integrated Circuit; Manufacturer_Name: Microchip; Manufacturer_Part_Number: AVR64DD32-I/PT | MULTI-VOLTAGE I/O; Datasheet Link: https://www.microchip.com/en-us/product/AVR64DD32; Height: 1.2mm
J3 = SD_Micro_Socket: Memory Card Connectors 9P R/A SMT MICRO SD HINGE PUSH-PULL; Manufacturer_Name: Hirose; Manufacturer_Part_Number: DM3CS-SF; Geometry.Height: 1.83mm; Mouser Part Number: 798-DM3CSSF; Mouser Price/Stock: https://www.mouser.co.uk/ProductDetail/Hirose-Connector/DM3CS-SF?qs=tTj%252BmQ3KZwbB9K5zh89Rcw%3D%3D; Datasheet Link: https://datasheet.lcsc.com/szlcsc/Hirose-HRS-DM3CS-SF_C202111.pdf
P2 = MHDR1X3_100: Header, 3-Pin; LatestRevisionDate: 17-Jul-2002; LatestRevisionNote: Re-released for DXP Platform.; Publisher: Altium Limited
R26-R31 = RC0603FR-1051KL: YAGEO 0603 51K; Manufacturer_Name: KEMET; Manufacturer_Part_Number: RC0603JR-070RL; Geometry.Height: 0.55mm; Mouser Part Number: 603-RC0603JR-070RL; Mouser Price/Stock: https://www.mouser.co.uk/ProductDetail/YAGEO/RC0603JR-070RL?qs=2cAdsCoAWRGWyPcuXgGiXQ%3D%3D; Datasheet Link: https://datasheet.datasheetarchive.com/originals/distributors/Datasheets_SAMA/902f9e387b938f871d31120f5fc1d65e.pdf
R32 = RC0603FR-104K7L: as R1 on sheet IO_Combo_Keyboard_Mouse; Mouser Part Number: 603-RC0603JR-070RL; Mouser Price/Stock: https://www.mouser.co.uk/ProductDetail/YAGEO/RC0603JR-070RL?qs=2cAdsCoAWRGWyPcuXgGiXQ%3D%3D; Datasheet Link: https://datasheet.datasheetarchive.com/originals/distributors/Datasheets_SAMA/902f9e387b938f871d31120f5fc1d65e.pdf
TP3 = TP_1X10: as TP1 on sheet IO_Combo_Keyboard_Mouse; Supplier 1: Digi-Key; RoHS: Yes; Category: Headers and Wire Housings; Stock 1: 227; Pricing 1: 1=2.85000, 10=2.73600, 100=2.28000, 500=1.93800, 1000=1.65300, 5000=1.48200 (USD); Mount: Through Hole; Contact Plating: Gold; Contact Material: Bronze; Housing Material: Polyester; Housing Color: Black; Color: Black; Min Operating Temperature: -55°C; Max Operating Temperature: 125°C; Number of Rows: 2; Termination: Solder; Packaging: Rail/Tube; Orientation: Straight; Number of Positions: 16; Length: 27.94mm; Depth: 9.27mm; Contact Mating Length: 0.25inch; REACH SVHC: No SVHC; ComponentLink1URL: https://datasheet.ciiva.com/739/tst-mkt-739845.pdf?src-supplier=Digi-Key; ComponentLink1Description: https://datasheet.ciiva.com/739/tst-mkt-739845.pdf?src-supplier=Digi-Key; ComponentLink2URL: https://datasheet.ciiva.com/10018/htst-10018510.pdf?src-supplier=Avnet; ComponentLink2Description: https://datasheet.ciiva.com/10018/htst-10018510.pdf?src-supplier=Avnet

## Sheet IO_Combo_USB_Serial.SchDoc: USB Serial
size Tabloid; Date: 09/21/2024; Engineer: Terry D. Schevker; Revision: 1.0; SheetNumber: 4; SheetTotal: 5
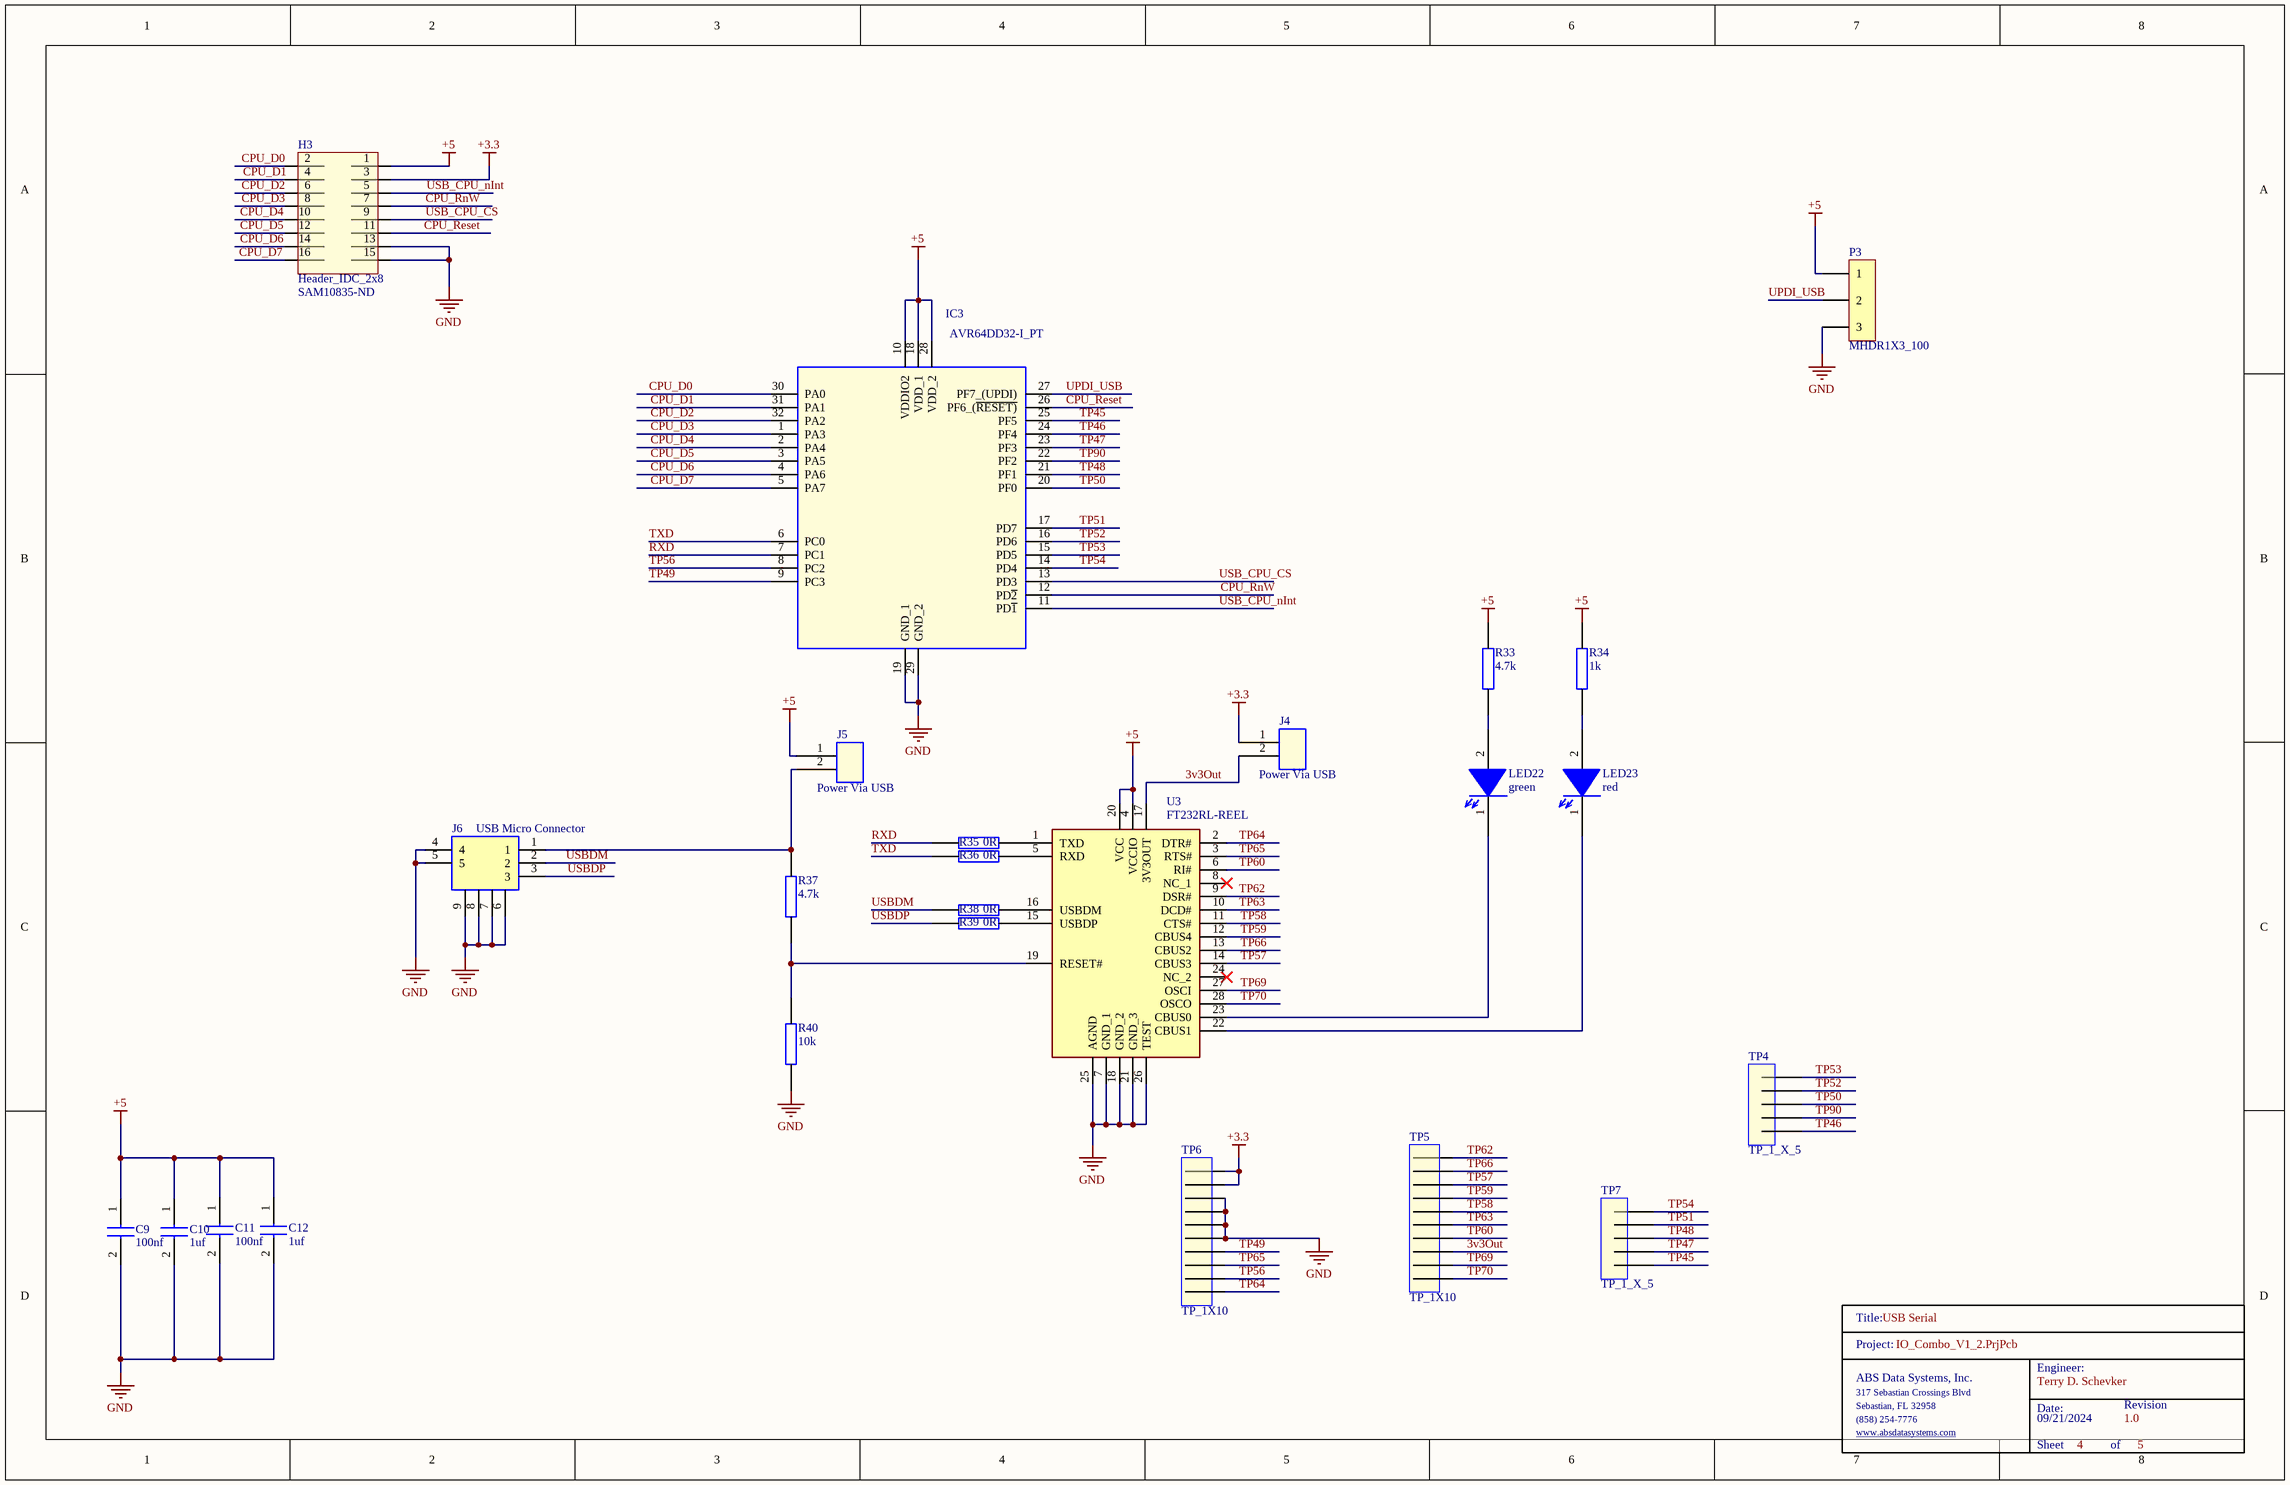
[diagram p3: IO_Combo_USB_Serial.SchDoc]

### Parts
(Parts that share a designator on the sheet are numbered #1, #2 ... from top to bottom, then left to right.)
C9  100nf  [0603]
C10  1uf  [0603]
C11  100nf  [0603]
C12  1uf  [0603]
H3  Header_IDC_2x8  Supplier Part Number 1: SAM10835-ND  [HEADER16]
IC3  AVR64DD32-I_PT  [QFP80P900X900X120-32N]
J4  Power Via USB  [Jumper]
J5  Power Via USB  [Jumper]
J6  USB Micro Connector  [1734035-2USB]
LED22  green  [0603_Diode]
LED23  red  [0603_Diode]
P3  MHDR1X3_100  [MHDR1X3_100]
R33  4.7k  [0603]
R34  1k  [0603]
R35  0R  [0603]
R36  0R  [0603]
R37  4.7k  [0603]
R38  0R  [0603]
R39  0R  [0603]
R40  10k  [0603]
TitleBlock_1#4  TitleBlock  (value not drawn)  (graphical)
TP4  TP_1_X_5  [TP_1X5]
TP5  TP_1X10  [TP_1X10]
TP6  TP_1X10  [TP_1X10]
TP7  TP_1_X_5  [TP_1X5]
U3  FT232RL-REEL  [SOIC-28_Narrow]

### Nets
+3.3: H3.3 J4.1 TP6.1 TP6.2
+5: C9.1 C10.1 C11.1 C12.1 H3.1 IC3.10(VDDIO2) IC3.18(VDD_1) IC3.28(VDD_2) J5.1 P3.1 R33.2 R34.2 U3.4(VCCIO) U3.20(VCC)
GND: C9.2 C10.2 C11.2 C12.2 H3.13 H3.15 IC3.19(GND_1) IC3.29(GND_2) J6.4 J6.5 J6.6(Shield) J6.7(Shield) J6.8(Shield) J6.9(Shield5) P3.3 R40.1 TP6.3 TP6.4 TP6.5 TP6.6 U3.7(GND_1) U3.18(GND_2) U3.21(GND_3) U3.25(AGND) U3.26(TEST)
3v3Out: J4.2 TP5.8 U3.17(3V3OUT)
CPU_D0: H3.2 IC3.30(PA0)
CPU_D1: H3.4 IC3.31(PA1)
CPU_D2: H3.6 IC3.32(PA2)
CPU_D3: H3.8 IC3.1(PA3)
CPU_D4: H3.10 IC3.2(PA4)
CPU_D5: H3.12 IC3.3(PA5)
CPU_D6: H3.14 IC3.4(PA6)
CPU_D7: H3.16 IC3.5(PA7)
CPU_Reset: H3.11 IC3.26(PF6_(~{RESET)})
CPU_RnW: H3.7 IC3.12(PD~{2})
RXD: IC3.7(PC1) R35.1
TP45: IC3.25(PF5) TP7.5
TP46: IC3.24(PF4) TP4.5
TP47: IC3.23(PF3) TP7.4
TP48: IC3.21(PF1) TP7.3
TP49: IC3.9(PC3) TP6.7
TP50: IC3.20(PF0) TP4.3
TP51: IC3.17(PD7) TP7.2
TP52: IC3.16(PD6) TP4.2
TP53: IC3.15(PD5) TP4.1
TP54: IC3.14(PD4) TP7.1
TP56: IC3.8(PC2) TP6.9
TP57: TP5.3 U3.14(CBUS3)
TP58: TP5.5 U3.11(CTS#)
TP59: TP5.4 U3.12(CBUS4)
TP60: TP5.7 U3.6(RI#)
TP62: TP5.1 U3.9(DSR#)
TP63: TP5.6 U3.10(DCD#)
TP64: TP6.10 U3.2(DTR#)
TP65: TP6.8 U3.3(RTS#)
TP66: TP5.2 U3.13(CBUS2)
TP69: TP5.9 U3.27(OSCI)
TP70: TP5.10 U3.28(OSCO)
TP90: IC3.22(PF2) TP4.4
TXD: IC3.6(PC0) R36.1
UPDI_USB: IC3.27(PF7_(UPDI)) P3.2
USB_CPU_CS: H3.9 IC3.13(PD3)
USB_CPU_nInt: H3.5 IC3.11(PD~{1})
USBDM: J6.2 R38.1
USBDP: J6.3 R39.1
NetJ5_2: J5.2 J6.1 R37.2
NetLED22_1: LED22.1(K) U3.23(CBUS0)
NetLED22_2: LED22.2(A) R33.1
NetLED23_1: LED23.1(K) U3.22(CBUS1)
NetLED23_2: LED23.2(A) R34.1
NetR35_2: R35.2 U3.1(TXD)
NetR36_2: R36.2 U3.5(RXD)
NetR37_1: R37.1 R40.2 U3.19(RESET#)
NetR38_2: R38.2 U3.16(USBDM)
NetR39_2: R39.2 U3.15(USBDP)

Not connected (* = marked no-connect by the designer): U3 8(NC_1)* 24(NC_2)*

### Notes on the sheet
- (in symbol TitleBlock) Title:; Project:; Engineer:; ABS Data Systems, Inc.; 317 Sebastian Crossings Blvd; Sebastian, FL 32958; Date:; Revision; (858) 254-7776; www.absdatasystems.com; Sheet; of

### Library data of the parts
C9 C11 = CL10B104JB8NNNC: Samsung Electro-Mechanics 0603 100nf
C10 C12 = CL10B105KA8NNNL: Samsung Electro-Mechanics 0603 1uf
H3 = Header_IDC_2x8: as H1 on sheet IO_Combo_Keyboard_Mouse; Supplier 1: Digi-Key; RoHS: Yes; Category: Headers and Wire Housings; Stock 1: 227; Pricing 1: 1=2.85000, 10=2.73600, 100=2.28000, 500=1.93800, 1000=1.65300, 5000=1.48200 (USD); Mount: Through Hole; Contact Plating: Gold; Contact Material: Bronze; Housing Material: Polyester; Housing Color: Black; Color: Black; Min Operating Temperature: -55°C; Max Operating Temperature: 125°C; Number of Rows: 2; Termination: Solder; Packaging: Rail/Tube; Orientation: Straight; Number of Positions: 16; Length: 27.94mm; Depth: 9.27mm; Contact Mating Length: 0.25inch; REACH SVHC: No SVHC; ComponentLink1URL: https://datasheet.ciiva.com/739/tst-mkt-739845.pdf?src-supplier=Digi-Key; ComponentLink1Description: https://datasheet.ciiva.com/739/tst-mkt-739845.pdf?src-supplier=Digi-Key; ComponentLink2URL: https://datasheet.ciiva.com/10018/htst-10018510.pdf?src-supplier=Avnet; ComponentLink2Description: https://datasheet.ciiva.com/10018/htst-10018510.pdf?src-supplier=Avnet
IC3 = AVR64DD32-I_PT: as IC1 on sheet IO_Combo_Keyboard_Mouse; Datasheet Link: https://www.microchip.com/en-us/product/AVR64DD32; Height: 1.2mm
J4 J5 = Jumper: 16 Pin 3x8 Through Hold Jumprts; Manufacturer: Samtec; Manufacturer Part Number: TST-108-01-G-D; Number of Contacts: 16; Gender: Male; Connector Type: Male Pin; Pitch: 2.54mm; Row Spacing: 0.1inch; Supplier 1: Digi-Key; RoHS: Yes; Category: Headers and Wire Housings; Stock 1: 227; Pricing 1: 1=2.85000, 10=2.73600, 100=2.28000, 500=1.93800, 1000=1.65300, 5000=1.48200 (USD); Mount: Through Hole; Contact Plating: Gold; Contact Material: Bronze; Housing Material: Polyester; Housing Color: Black; Color: Black; Min Operating Temperature: -55°C; Max Operating Temperature: 125°C; Number of Rows: 2; Termination: Solder; Packaging: Rail/Tube; Orientation: Straight; Number of Positions: 16; Length: 27.94mm; Depth: 9.27mm; Contact Mating Length: 0.25inch; REACH SVHC: No SVHC; ComponentLink1URL: https://datasheet.ciiva.com/739/tst-mkt-739845.pdf?src-supplier=Digi-Key; ComponentLink1Description: https://datasheet.ciiva.com/739/tst-mkt-739845.pdf?src-supplier=Digi-Key; ComponentLink2URL: https://datasheet.ciiva.com/10018/htst-10018510.pdf?src-supplier=Avnet; ComponentLink2Description: https://datasheet.ciiva.com/10018/htst-10018510.pdf?src-supplier=Avnet
J6 = 1734035-4: USB Micro Connector SMD; Manufacturer_Name: TE Connectivity; Datasheet Link: https://componentsearchengine.com//1734035-4.pdf; Mouser2 Part Number: 571-1734035-4; Mouser2 Price/Stock: https://www.mouser.com/Search/Refine.aspx?Keyword=571-1734035-4; Manufacturer_Part_Number: 1734035-4
LED22 = 150060GS75000: as LED10 on sheet IO_Combo_LED_Monitor; Supplier 1: Digi-Key; Manufacturer Part Number: 150060GS75000; RoHS: Yes; Category: LEDs; Stock 1: 71509; Pricing 1: 1=0.14000, 50=0.13300, 100=0.11400, 500=0.09900 (USD); Mount: Surface Mount; Case/Package: 0603; Color: Green; Case Code (Metric): 1608; Case Code (Imperial): 0603; Min Operating Temperature: -40°C; Max Operating Temperature: 85°C; Package Quantity: 4000; Packaging: Tape and Reel; Dominant Wavelength: 520nm; Length: 1.6mm; Width: 0.8mm; Height: 0.7mm; REACH SVHC: Unknown; Lead Free: Lead Free; ComponentLink1URL: https://datasheet.ciiva.com/29562/150060gs75000-29562868.pdf?src-supplier=Digi-Key; ComponentLink1Description: https://datasheet.ciiva.com/29562/150060gs75000-29562868.pdf?src-supplier=Digi-Key; ComponentLink2URL: https://datasheet.ciiva.com/29279/759427-da-01-en-chipled-0603-w-kl-gruen-150060gs75000-29279201.pdf?src-supplier=Conrad; ComponentLink2Description: https://datasheet.ciiva.com/29279/759427-da-01-en-chipled-0603-w-kl-gruen-150060gs75000-29279201.pdf?src-supplier=Conrad; ComponentLink3URL: https://datasheet.ciiva.com/29562/150060gs75000-29562869.pdf?src-supplier=Digi-Key; ComponentLink3Description: https://datasheet.ciiva.com/29562/150060gs75000-29562869.pdf?src-supplier=Digi-Key; ComponentLink4URL: https://datasheet.ciiva.com/29562/150060gs75000-29562870.pdf?src-supplier=Digi-Key; ComponentLink4Description: https://datasheet.ciiva.com/29562/150060gs75000-29562870.pdf?src-supplier=Digi-Key
LED23 = 150060RS75000: as LED1 on sheet IO_Combo_LED_Monitor; Supplier 1: Digi-Key; RoHS: Yes; Category: LEDs; Stock 1: 71509; Pricing 1: 1=0.14000, 50=0.13300, 100=0.11400, 500=0.09900 (USD); Mount: Surface Mount; Case/Package: 0603; Case Code (Metric): 1608; Case Code (Imperial): 0603; Min Operating Temperature: -40°C; Max Operating Temperature: 85°C; Package Quantity: 4000; Packaging: Tape and Reel; Dominant Wavelength: 520nm; Length: 1.6mm; Width: 0.8mm; Height: 0.7mm; REACH SVHC: Unknown; Lead Free: Lead Free; ComponentLink1URL: https://datasheet.ciiva.com/29562/150060gs75000-29562868.pdf?src-supplier=Digi-Key; ComponentLink1Description: https://datasheet.ciiva.com/29562/150060gs75000-29562868.pdf?src-supplier=Digi-Key; ComponentLink2URL: https://datasheet.ciiva.com/29279/759427-da-01-en-chipled-0603-w-kl-gruen-150060gs75000-29279201.pdf?src-supplier=Conrad; ComponentLink2Description: https://datasheet.ciiva.com/29279/759427-da-01-en-chipled-0603-w-kl-gruen-150060gs75000-29279201.pdf?src-supplier=Conrad; ComponentLink3URL: https://datasheet.ciiva.com/29562/150060gs75000-29562869.pdf?src-supplier=Digi-Key; ComponentLink3Description: https://datasheet.ciiva.com/29562/150060gs75000-29562869.pdf?src-supplier=Digi-Key; ComponentLink4URL: https://datasheet.ciiva.com/29562/150060gs75000-29562870.pdf?src-supplier=Digi-Key; ComponentLink4Description: https://datasheet.ciiva.com/29562/150060gs75000-29562870.pdf?src-supplier=Digi-Key
P3 = MHDR1X3_100: Header, 3-Pin; LatestRevisionDate: 17-Jul-2002; LatestRevisionNote: Re-released for DXP Platform.; Publisher: Altium Limited
R33 R37 = RC0603FR-104K7L: as R1 on sheet IO_Combo_Keyboard_Mouse; Mouser Part Number: 603-RC0603JR-070RL; Mouser Price/Stock: https://www.mouser.co.uk/ProductDetail/YAGEO/RC0603JR-070RL?qs=2cAdsCoAWRGWyPcuXgGiXQ%3D%3D; Datasheet Link: https://datasheet.datasheetarchive.com/originals/distributors/Datasheets_SAMA/902f9e387b938f871d31120f5fc1d65e.pdf
R34 = AC0603FR-7W1KL_1: as R5 on sheet IO_Combo_LED_Monitor; Mouser Part Number: 603-RC0603JR-070RL; Mouser Price/Stock: https://www.mouser.co.uk/ProductDetail/YAGEO/RC0603JR-070RL?qs=2cAdsCoAWRGWyPcuXgGiXQ%3D%3D; Datasheet Link: https://datasheet.datasheetarchive.com/originals/distributors/Datasheets_SAMA/902f9e387b938f871d31120f5fc1d65e.pdf
R35 R36 R38 R39 = RC0603JR-070RL: YAGEO 0603 0 ohm; Manufacturer_Name: KEMET; Geometry.Height: 0.55mm; Mouser Part Number: 603-RC0603JR-070RL; Mouser Price/Stock: https://www.mouser.co.uk/ProductDetail/YAGEO/RC0603JR-070RL?qs=2cAdsCoAWRGWyPcuXgGiXQ%3D%3D; Manufacturer_Part_Number: RC0603JR-070RL; Datasheet Link: https://datasheet.datasheetarchive.com/originals/distributors/Datasheets_SAMA/902f9e387b938f871d31120f5fc1d65e.pdf
R40 = RC0603JR-0710KL: YAGEO 0603 10k ohm; Manufacturer_Name: KEMET; Manufacturer_Part_Number: RC0603JR-070RL; Geometry.Height: 0.55mm; Mouser Part Number: 603-RC0603JR-070RL; Mouser Price/Stock: https://www.mouser.co.uk/ProductDetail/YAGEO/RC0603JR-070RL?qs=2cAdsCoAWRGWyPcuXgGiXQ%3D%3D; Datasheet Link: https://datasheet.datasheetarchive.com/originals/distributors/Datasheets_SAMA/902f9e387b938f871d31120f5fc1d65e.pdf
TP4 TP7 = TP_1_X_5: Manufacturer: Samtec; Manufacturer Part Number: TST-105-01-G-D; Number of Contacts: 16; Gender: Male; Connector Type: Male Pin; Pitch: 2.54mm; Row Spacing: 0.1inch; Supplier 1: Digi-Key; RoHS: Yes; Category: Headers and Wire Housings; Stock 1: 227; Pricing 1: 1=2.85000, 10=2.73600, 100=2.28000, 500=1.93800, 1000=1.65300, 5000=1.48200 (USD); Mount: Through Hole; Contact Plating: Gold; Contact Material: Bronze; Housing Material: Polyester; Housing Color: Black; Color: Black; Min Operating Temperature: -55°C; Max Operating Temperature: 125°C; Number of Rows: 2; Termination: Solder; Packaging: Rail/Tube; Orientation: Straight; Number of Positions: 16; Length: 27.94mm; Depth: 9.27mm; Contact Mating Length: 0.25inch; REACH SVHC: No SVHC; ComponentLink1URL: https://datasheet.ciiva.com/739/tst-mkt-739845.pdf?src-supplier=Digi-Key; ComponentLink1Description: https://datasheet.ciiva.com/739/tst-mkt-739845.pdf?src-supplier=Digi-Key; ComponentLink2URL: https://datasheet.ciiva.com/10018/htst-10018510.pdf?src-supplier=Avnet; ComponentLink2Description: https://datasheet.ciiva.com/10018/htst-10018510.pdf?src-supplier=Avnet
TP5 TP6 = TP_1X10: as TP1 on sheet IO_Combo_Keyboard_Mouse; Supplier 1: Digi-Key; RoHS: Yes; Category: Headers and Wire Housings; Stock 1: 227; Pricing 1: 1=2.85000, 10=2.73600, 100=2.28000, 500=1.93800, 1000=1.65300, 5000=1.48200 (USD); Mount: Through Hole; Contact Plating: Gold; Contact Material: Bronze; Housing Material: Polyester; Housing Color: Black; Color: Black; Min Operating Temperature: -55°C; Max Operating Temperature: 125°C; Number of Rows: 2; Termination: Solder; Packaging: Rail/Tube; Orientation: Straight; Number of Positions: 16; Length: 27.94mm; Depth: 9.27mm; Contact Mating Length: 0.25inch; REACH SVHC: No SVHC; ComponentLink1URL: https://datasheet.ciiva.com/739/tst-mkt-739845.pdf?src-supplier=Digi-Key; ComponentLink1Description: https://datasheet.ciiva.com/739/tst-mkt-739845.pdf?src-supplier=Digi-Key; ComponentLink2URL: https://datasheet.ciiva.com/10018/htst-10018510.pdf?src-supplier=Avnet; ComponentLink2Description: https://datasheet.ciiva.com/10018/htst-10018510.pdf?src-supplier=Avnet
U3 = FT232RL-REEL: USB-Serial SMD; Manufacturer_Name: FTDI Chip; Datasheet Link: http://www.ftdichip.com/Support/Documents/DataSheets/ICs/DS_FT232R.pdf; Height: 2mm; Manufacturer_Part_Number: FT232RL-REEL

## Sheet IO_Combo_WiFi.SchDoc: WiFi Module
size Tabloid; Date: 09/21/2024; Engineer: Terry D. Schevker; Revision: 1.0; SheetNumber: 5; SheetTotal: 5
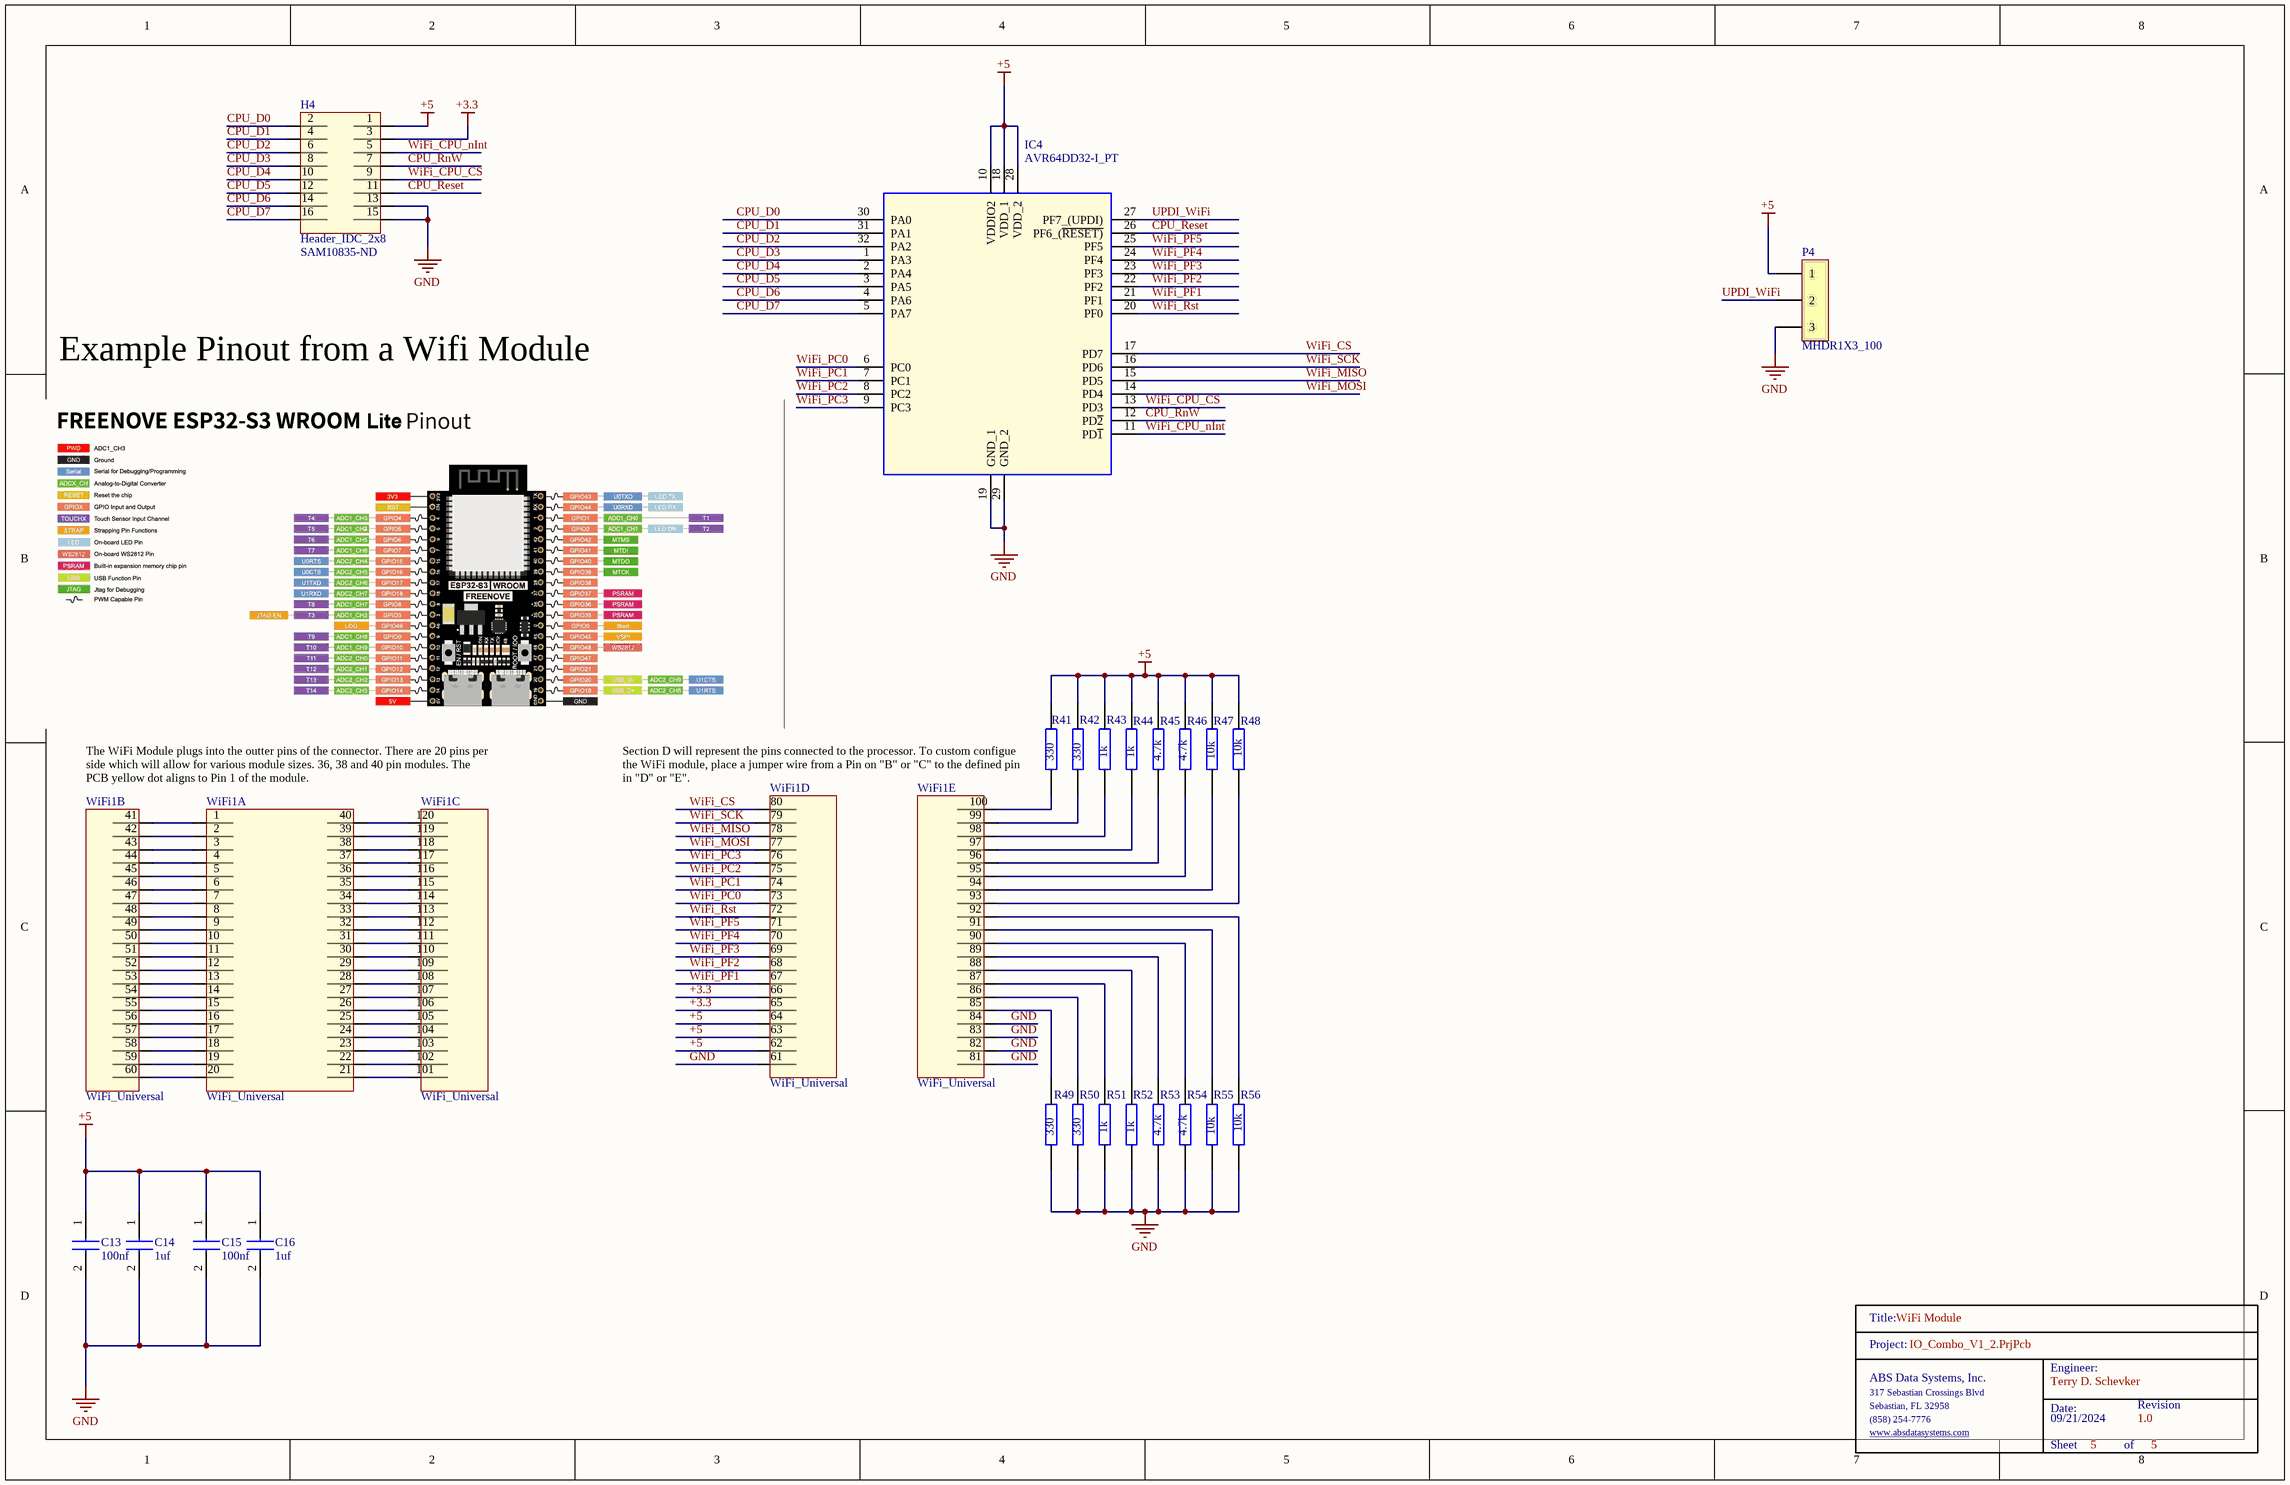
[diagram p4: IO_Combo_WiFi.SchDoc]

### Parts
(Parts that share a designator on the sheet are numbered #1, #2 ... from top to bottom, then left to right.)
C13  100nf  [0603]
C14  1uf  [0603]
C15  100nf  [0603]
C16  1uf  [0603]
H4  Header_IDC_2x8  Supplier Part Number 1: SAM10835-ND  [HEADER16]
IC4  AVR64DD32-I_PT  [QFP80P900X900X120-32N]
P4  MHDR1X3_100  [MHDR1X3_100]
R41  330  [0603]
R42  330  [0603]
R43  1k  [0603]
R44  1k  [0603]
R45  4.7k  [0603]
R46  4.7k  [0603]
R47  10k  [0603]
R48  10k  [0603]
R49  330  [0603]
R50  330  [0603]
R51  1k  [0603]
R52  1k  [0603]
R53  4.7k  [0603]
R54  4.7k  [0603]
R55  10k  [0603]
R56  10k  [0603]
TitleBlock_1#5  TitleBlock  (value not drawn)  (graphical)
WiFi1  WiFi_Universal  [WiFI_Universal]  (parts A,B,C,D,E of 5)

### Nets
+3.3: H4.3 WiFi1.65 WiFi1.66
+5: C13.1 C14.1 C15.1 C16.1 H4.1 IC4.10(VDDIO2) IC4.18(VDD_1) IC4.28(VDD_2) P4.1 R41.1 R42.1 R43.1 R44.1 R45.1 R46.1 R47.1 R48.1 WiFi1.62 WiFi1.63 WiFi1.64
GND: C13.2 C14.2 C15.2 C16.2 H4.13 H4.15 IC4.19(GND_1) IC4.29(GND_2) P4.3 R49.2 R50.2 R51.2 R52.2 R53.2 R54.2 R55.2 R56.2 WiFi1.61 WiFi1.81 WiFi1.82 WiFi1.83 WiFi1.84
CPU_D0: H4.2 IC4.30(PA0)
CPU_D1: H4.4 IC4.31(PA1)
CPU_D2: H4.6 IC4.32(PA2)
CPU_D3: H4.8 IC4.1(PA3)
CPU_D4: H4.10 IC4.2(PA4)
CPU_D5: H4.12 IC4.3(PA5)
CPU_D6: H4.14 IC4.4(PA6)
CPU_D7: H4.16 IC4.5(PA7)
CPU_Reset: H4.11 IC4.26(PF6_(~{RESET)})
CPU_RnW: H4.7 IC4.12(PD~{2})
UPDI_WiFi: IC4.27(PF7_(UPDI)) P4.2
WiFi_CPU_CS: H4.9 IC4.13(PD3)
WiFi_CPU_nInt: H4.5 IC4.11(PD~{1})
WiFi_CS: IC4.17(PD7) WiFi1.80
WiFi_MISO: IC4.15(PD5) WiFi1.78
WiFi_MOSI: IC4.14(PD4) WiFi1.77
WiFi_PC0: IC4.6(PC0) WiFi1.73
WiFi_PC1: IC4.7(PC1) WiFi1.74
WiFi_PC2: IC4.8(PC2) WiFi1.75
WiFi_PC3: IC4.9(PC3) WiFi1.76
WiFi_PF1: IC4.21(PF1) WiFi1.67
WiFi_PF2: IC4.22(PF2) WiFi1.68
WiFi_PF3: IC4.23(PF3) WiFi1.69
WiFi_PF4: IC4.24(PF4) WiFi1.70
WiFi_PF5: IC4.25(PF5) WiFi1.71
WiFi_Rst: IC4.20(PF0) WiFi1.72
WiFi_SCK: IC4.16(PD6) WiFi1.79
NetR41_2: R41.2 WiFi1.100
NetR42_2: R42.2 WiFi1.99
NetR43_2: R43.2 WiFi1.98
NetR44_2: R44.2 WiFi1.97
NetR45_2: R45.2 WiFi1.96
NetR46_2: R46.2 WiFi1.95
NetR47_2: R47.2 WiFi1.94
NetR48_2: R48.2 WiFi1.93
NetR49_1: R49.1 WiFi1.85
NetR50_1: R50.1 WiFi1.86
NetR51_1: R51.1 WiFi1.87
NetR52_1: R52.1 WiFi1.88
NetR53_1: R53.1 WiFi1.89
NetR54_1: R54.1 WiFi1.90
NetR55_1: R55.1 WiFi1.91
NetR56_1: R56.1 WiFi1.92
NetWiFi1_1: WiFi1.1 WiFi1.41
NetWiFi1_2: WiFi1.2 WiFi1.42
NetWiFi1_3: WiFi1.3 WiFi1.43
NetWiFi1_4: WiFi1.4 WiFi1.44
NetWiFi1_5: WiFi1.5 WiFi1.45
NetWiFi1_6: WiFi1.6 WiFi1.46
NetWiFi1_7: WiFi1.7 WiFi1.47
NetWiFi1_8: WiFi1.8 WiFi1.48
NetWiFi1_9: WiFi1.9 WiFi1.49
NetWiFi1_10: WiFi1.10 WiFi1.50
NetWiFi1_11: WiFi1.11 WiFi1.51
NetWiFi1_12: WiFi1.12 WiFi1.52
NetWiFi1_13: WiFi1.13 WiFi1.53
NetWiFi1_14: WiFi1.14 WiFi1.54
NetWiFi1_15: WiFi1.15 WiFi1.55
NetWiFi1_16: WiFi1.16 WiFi1.56
NetWiFi1_17: WiFi1.17 WiFi1.57
NetWiFi1_18: WiFi1.18 WiFi1.58
NetWiFi1_19: WiFi1.19 WiFi1.59
NetWiFi1_20: WiFi1.20 WiFi1.60
NetWiFi1_21: WiFi1.21 WiFi1.101
NetWiFi1_22: WiFi1.22 WiFi1.102
NetWiFi1_23: WiFi1.23 WiFi1.103
NetWiFi1_24: WiFi1.24 WiFi1.104
NetWiFi1_25: WiFi1.25 WiFi1.105
NetWiFi1_26: WiFi1.26 WiFi1.106
NetWiFi1_27: WiFi1.27 WiFi1.107
NetWiFi1_28: WiFi1.28 WiFi1.108
NetWiFi1_29: WiFi1.29 WiFi1.109
NetWiFi1_30: WiFi1.30 WiFi1.110
NetWiFi1_31: WiFi1.31 WiFi1.111
NetWiFi1_32: WiFi1.32 WiFi1.112
NetWiFi1_33: WiFi1.33 WiFi1.113
NetWiFi1_34: WiFi1.34 WiFi1.114
NetWiFi1_35: WiFi1.35 WiFi1.115
NetWiFi1_36: WiFi1.36 WiFi1.116
NetWiFi1_37: WiFi1.37 WiFi1.117
NetWiFi1_38: WiFi1.38 WiFi1.118
NetWiFi1_39: WiFi1.39 WiFi1.119
NetWiFi1_40: WiFi1.40 WiFi1.120

### Notes on the sheet
- Example Pinout from a Wifi Module
- (near WiFi1) The WiFi Module plugs into the outter pins of the connector. There are 20 pins per side which will allow for various module sizes. 36, 38 and 40 pin modules. The PCB yellow dot aligns to Pin 1 of the module.
- Section D will represent the pins connected to the processor. To custom configue the WiFi module, place a jumper wire from a Pin on "B" or "C" to the defined pin in "D" or "E".
- (in symbol TitleBlock) Title:; Project:; Engineer:; ABS Data Systems, Inc.; 317 Sebastian Crossings Blvd; Sebastian, FL 32958; Date:; Revision; (858) 254-7776; www.absdatasystems.com; Sheet; of

### Library data of the parts
C13 C15 = CL10B104JB8NNNC: Samsung Electro-Mechanics 0603 100nf
C14 C16 = CL10B105KA8NNNL: Samsung Electro-Mechanics 0603 1uf
H4 = Header_IDC_2x8: as H1 on sheet IO_Combo_Keyboard_Mouse; Supplier 1: Digi-Key; RoHS: Yes; Category: Headers and Wire Housings; Stock 1: 227; Pricing 1: 1=2.85000, 10=2.73600, 100=2.28000, 500=1.93800, 1000=1.65300, 5000=1.48200 (USD); Mount: Through Hole; Contact Plating: Gold; Contact Material: Bronze; Housing Material: Polyester; Housing Color: Black; Color: Black; Min Operating Temperature: -55°C; Max Operating Temperature: 125°C; Number of Rows: 2; Termination: Solder; Packaging: Rail/Tube; Orientation: Straight; Number of Positions: 16; Length: 27.94mm; Depth: 9.27mm; Contact Mating Length: 0.25inch; REACH SVHC: No SVHC; ComponentLink1URL: https://datasheet.ciiva.com/739/tst-mkt-739845.pdf?src-supplier=Digi-Key; ComponentLink1Description: https://datasheet.ciiva.com/739/tst-mkt-739845.pdf?src-supplier=Digi-Key; ComponentLink2URL: https://datasheet.ciiva.com/10018/htst-10018510.pdf?src-supplier=Avnet; ComponentLink2Description: https://datasheet.ciiva.com/10018/htst-10018510.pdf?src-supplier=Avnet
IC4 = AVR64DD32-I_PT: as IC1 on sheet IO_Combo_Keyboard_Mouse; Datasheet Link: https://www.microchip.com/en-us/product/AVR64DD32; Height: 1.2mm
P4 = MHDR1X3_100: Header, 3-Pin; LatestRevisionDate: 17-Jul-2002; LatestRevisionNote: Re-released for DXP Platform.; Publisher: Altium Limited
R41 R42 R49 R50 = AC0603FR-10330RL: YAGEO 0603 330 ohm; Manufacturer_Name: KEMET; Manufacturer_Part_Number: RC0603JR-070RL; Geometry.Height: 0.55mm; Mouser Part Number: 603-RC0603JR-070RL; Mouser Price/Stock: https://www.mouser.co.uk/ProductDetail/YAGEO/RC0603JR-070RL?qs=2cAdsCoAWRGWyPcuXgGiXQ%3D%3D; Datasheet Link: https://datasheet.datasheetarchive.com/originals/distributors/Datasheets_SAMA/902f9e387b938f871d31120f5fc1d65e.pdf
R43 R44 R51 R52 = AC0603FR-7W1KL_1: as R5 on sheet IO_Combo_LED_Monitor; Mouser Part Number: 603-RC0603JR-070RL; Mouser Price/Stock: https://www.mouser.co.uk/ProductDetail/YAGEO/RC0603JR-070RL?qs=2cAdsCoAWRGWyPcuXgGiXQ%3D%3D; Datasheet Link: https://datasheet.datasheetarchive.com/originals/distributors/Datasheets_SAMA/902f9e387b938f871d31120f5fc1d65e.pdf
R45 R46 R53 R54 = RC0603FR-104K7L: as R1 on sheet IO_Combo_Keyboard_Mouse; Mouser Part Number: 603-RC0603JR-070RL; Mouser Price/Stock: https://www.mouser.co.uk/ProductDetail/YAGEO/RC0603JR-070RL?qs=2cAdsCoAWRGWyPcuXgGiXQ%3D%3D; Datasheet Link: https://datasheet.datasheetarchive.com/originals/distributors/Datasheets_SAMA/902f9e387b938f871d31120f5fc1d65e.pdf
R47 R48 R55 R56 = RC0603JR-0710KL: as R40 on sheet IO_Combo_USB_Serial; Mouser Part Number: 603-RC0603JR-070RL; Mouser Price/Stock: https://www.mouser.co.uk/ProductDetail/YAGEO/RC0603JR-070RL?qs=2cAdsCoAWRGWyPcuXgGiXQ%3D%3D; Datasheet Link: https://datasheet.datasheetarchive.com/originals/distributors/Datasheets_SAMA/902f9e387b938f871d31120f5fc1d65e.pdf

## Nets that join several sheets
+3.3: IO_Combo_Keyboard_Mouse (H1.3), IO_Combo_LED_Monitor (R15.2), IO_Combo_SD (12 pins), IO_Combo_USB_Serial (H3.3 J4.1 TP6.1 TP6.2), IO_Combo_WiFi (H4.3 WiFi1.65 WiFi1.66)
+5: IO_Combo_Keyboard_Mouse (15 pins), IO_Combo_LED_Monitor (23 pins), IO_Combo_SD (12 pins), IO_Combo_USB_Serial (14 pins), IO_Combo_WiFi (20 pins)
GND: IO_Combo_Keyboard_Mouse (15 pins), IO_Combo_LED_Monitor (7 pins), IO_Combo_SD (17 pins), IO_Combo_USB_Serial (25 pins), IO_Combo_WiFi (22 pins)
CPU_D0: IO_Combo_Keyboard_Mouse (H1.2 IC1.30), IO_Combo_LED_Monitor (U1.2), IO_Combo_SD (H2.2 IC2.30), IO_Combo_USB_Serial (H3.2 IC3.30), IO_Combo_WiFi (H4.2 IC4.30)
CPU_D1: IO_Combo_Keyboard_Mouse (H1.4 IC1.31), IO_Combo_LED_Monitor (U1.4), IO_Combo_SD (H2.4 IC2.31), IO_Combo_USB_Serial (H3.4 IC3.31), IO_Combo_WiFi (H4.4 IC4.31)
CPU_D2: IO_Combo_Keyboard_Mouse (H1.6 IC1.32), IO_Combo_LED_Monitor (U1.6), IO_Combo_SD (H2.6 IC2.32), IO_Combo_USB_Serial (H3.6 IC3.32), IO_Combo_WiFi (H4.6 IC4.32)
CPU_D3: IO_Combo_Keyboard_Mouse (H1.8 IC1.1), IO_Combo_LED_Monitor (U1.8), IO_Combo_SD (H2.8 IC2.1), IO_Combo_USB_Serial (H3.8 IC3.1), IO_Combo_WiFi (H4.8 IC4.1)
CPU_D4: IO_Combo_Keyboard_Mouse (H1.10 IC1.2), IO_Combo_LED_Monitor (U1.11), IO_Combo_SD (H2.10 IC2.2), IO_Combo_USB_Serial (H3.10 IC3.2), IO_Combo_WiFi (H4.10 IC4.2)
CPU_D5: IO_Combo_Keyboard_Mouse (H1.12 IC1.3), IO_Combo_LED_Monitor (U1.13), IO_Combo_SD (H2.12 IC2.3), IO_Combo_USB_Serial (H3.12 IC3.3), IO_Combo_WiFi (H4.12 IC4.3)
CPU_D6: IO_Combo_Keyboard_Mouse (H1.14 IC1.4), IO_Combo_LED_Monitor (U1.15), IO_Combo_SD (H2.14 IC2.4), IO_Combo_USB_Serial (H3.14 IC3.4), IO_Combo_WiFi (H4.14 IC4.4)
CPU_D7: IO_Combo_Keyboard_Mouse (H1.16 IC1.5), IO_Combo_LED_Monitor (U1.17), IO_Combo_SD (H2.16 IC2.5), IO_Combo_USB_Serial (H3.16 IC3.5), IO_Combo_WiFi (H4.16 IC4.5)
CPU_Reset: IO_Combo_Keyboard_Mouse (H1.11 IC1.26), IO_Combo_LED_Monitor (LED5.1), IO_Combo_SD (H2.11 IC2.26), IO_Combo_USB_Serial (H3.11 IC3.26), IO_Combo_WiFi (H4.11 IC4.26)
CPU_RnW: IO_Combo_Keyboard_Mouse (H1.7 IC1.12), IO_Combo_LED_Monitor (U2.1), IO_Combo_SD (H2.7 IC2.12), IO_Combo_USB_Serial (H3.7 IC3.12), IO_Combo_WiFi (H4.7 IC4.12)
KM_CPU_CS: IO_Combo_Keyboard_Mouse (H1.9 IC1.13), IO_Combo_LED_Monitor (LED6.1)
KM_CPU_nInt: IO_Combo_Keyboard_Mouse (H1.5 IC1.11), IO_Combo_LED_Monitor (LED4.1)
SD_CPU_CS: IO_Combo_LED_Monitor (LED9.1), IO_Combo_SD (H2.9 IC2.13)
SD_CPU_nInt: IO_Combo_LED_Monitor (LED3.1), IO_Combo_SD (H2.5 IC2.11)
USB_CPU_CS: IO_Combo_LED_Monitor (LED8.1), IO_Combo_USB_Serial (H3.9 IC3.13)
USB_CPU_nInt: IO_Combo_LED_Monitor (LED2.1), IO_Combo_USB_Serial (H3.5 IC3.11)
WiFi_CPU_CS: IO_Combo_LED_Monitor (LED7.1), IO_Combo_WiFi (H4.9 IC4.13)
WiFi_CPU_nInt: IO_Combo_LED_Monitor (LED1.1), IO_Combo_WiFi (H4.5 IC4.11)